# EAGLE design design (EAGLE 7.3.0)

## Sheet 1 of 4: LAN Transformer
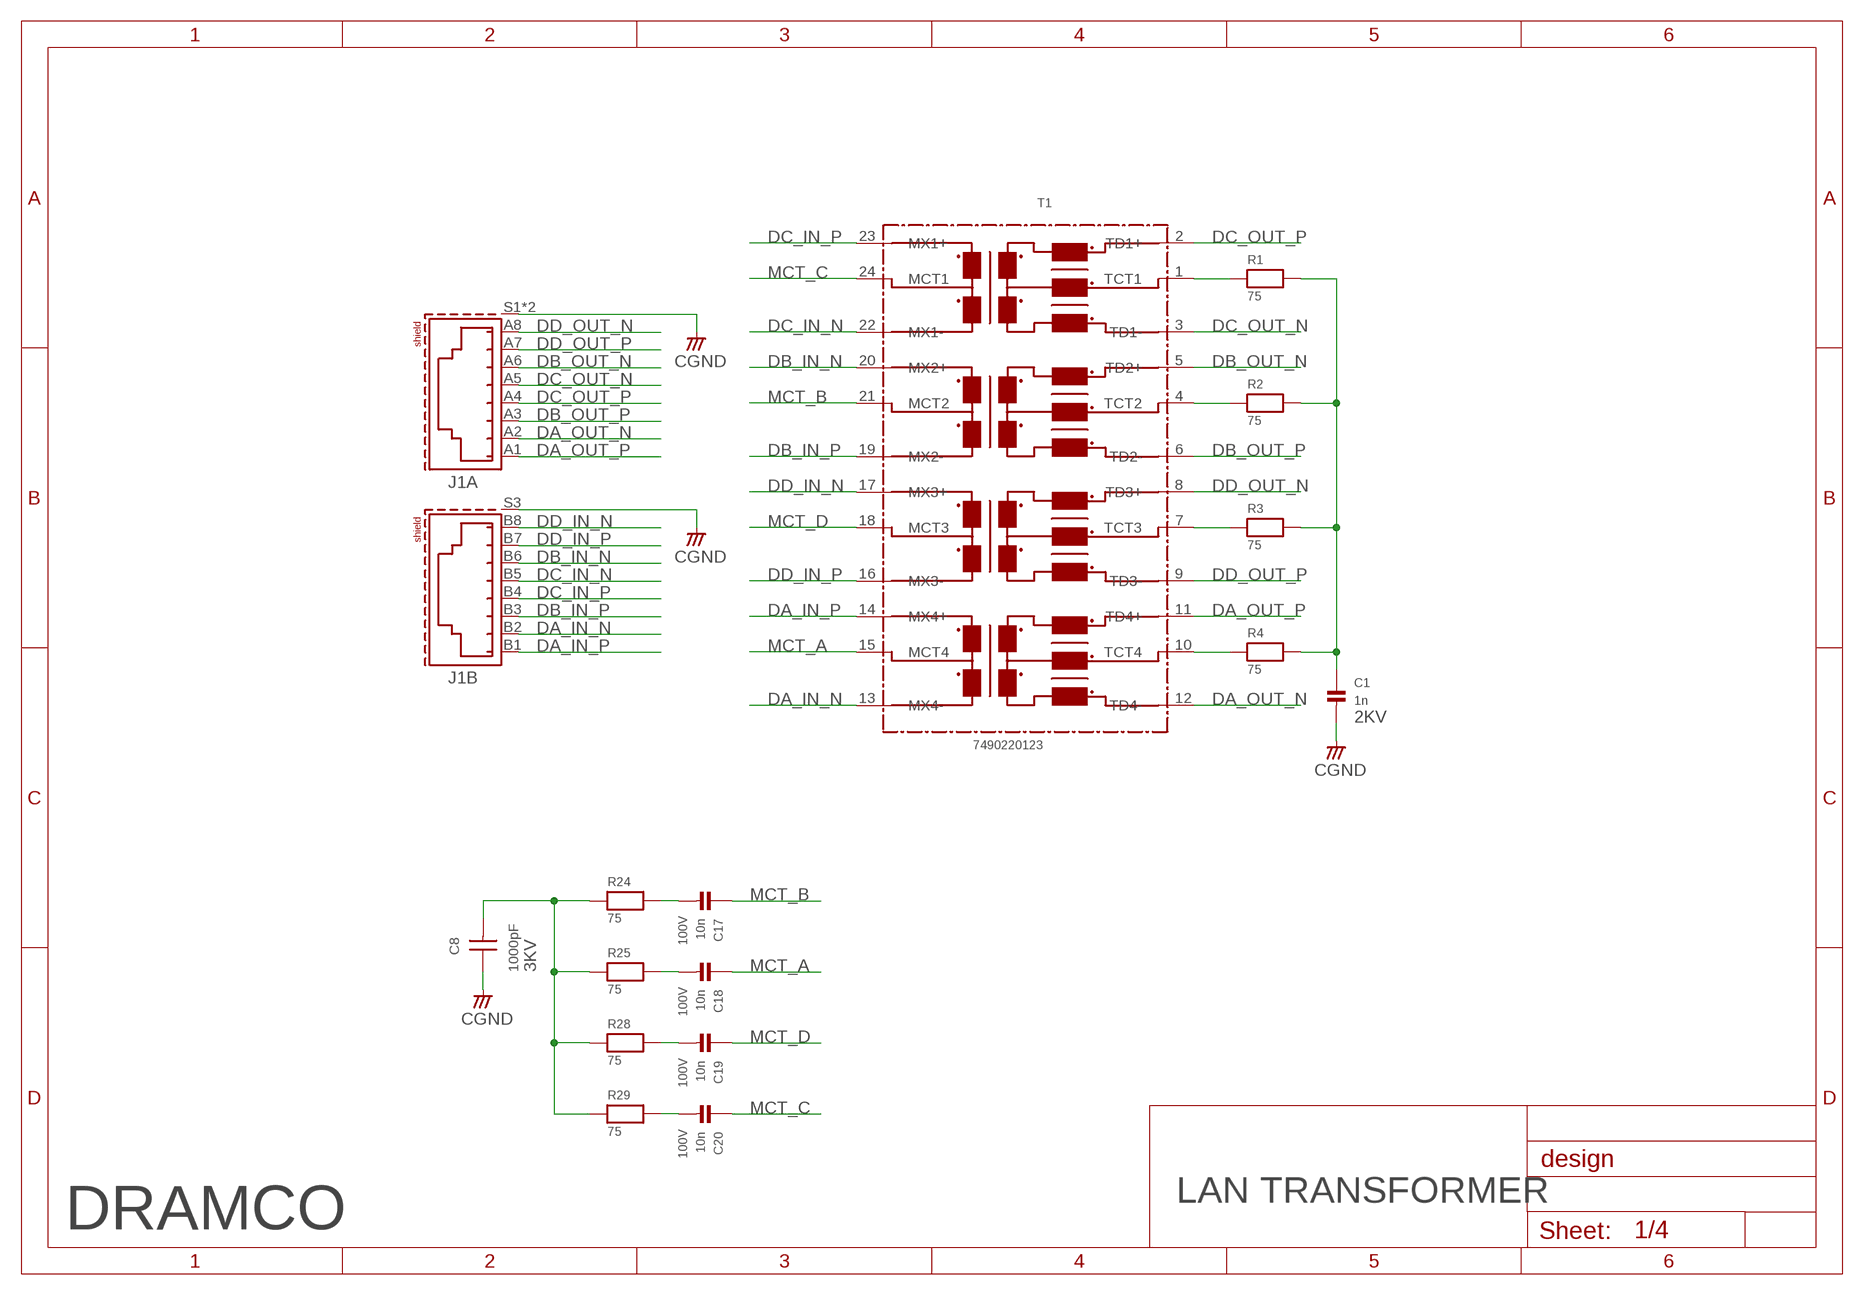
[diagram p0: schematic, sheet 1]

### Parts
C1  1n  CAP_CERAMIC1206  [1206]
C8  1000pF  WCAP-CSMH_1808_H2.0_885342210004  [WCAP-CSMH_1808_H2.0]
C17  10n  CAP_CERAMIC0603  [0603]
C18  10n  CAP_CERAMIC0603  [0603]
C19  10n  CAP_CERAMIC0603  [0603]
C20  10n  CAP_CERAMIC0603  [0603]
J1  615016137621  [615016137621]
R1  75  RESISTOR0805  [0805]
R2  75  RESISTOR0805  [0805]
R3  75  RESISTOR0805  [0805]
R4  75  RESISTOR0805  [0805]
R24  75  RESISTOR0805  [0805]
R25  75  RESISTOR0805  [0805]
R28  75  RESISTOR0805  [0805]
R29  75  RESISTOR0805  [0805]
T1  7490220123  WE-LAN_749022012X_7490220122  [749022012X]

### Nets
CGND: C1.2 C8.1 J1.S1(A:SHIELD) J1.S2(A:SHIELD) J1.S3(B:SHIELD)
DA_IN_N: J1.B2 T1.13(MX4-)
DA_IN_P: J1.B1 T1.14(MX4+)
DA_OUT_N: J1.A2 T1.12(TD4-)
DA_OUT_P: J1.A1 T1.11(TD4+)
DB_IN_N: J1.B6 T1.20(MX2+)
DB_IN_P: J1.B3 T1.19(MX2-)
DB_OUT_N: J1.A6 T1.5(TD2+)
DB_OUT_P: J1.A3 T1.6(TD2-)
DC_IN_N: J1.B5 T1.22(MX1-)
DC_IN_P: J1.B4 T1.23(MX1+)
DC_OUT_N: J1.A5 T1.3(TD1-)
DC_OUT_P: J1.A4 T1.2(TD1+)
DD_IN_N: J1.B8 T1.17(MX3+)
DD_IN_P: J1.B7 T1.16(MX3-)
DD_OUT_N: J1.A8 T1.8(TD3+)
DD_OUT_P: J1.A7 T1.9(TD3-)
MCT_A: C18.1 T1.15(MCT4) ; also sheet 2
MCT_B: C17.1 T1.21(MCT2) ; also sheet 2
MCT_C: C20.1 T1.24(MCT1) ; also sheet 2
MCT_D: C19.1 T1.18(MCT3) ; also sheet 2
N$1: R4.1 T1.10(TCT4)
N$2: R3.1 T1.7(TCT3)
N$3: R2.1 T1.4(TCT2)
N$5: R1.1 T1.1(TCT1)
N$7: C1.1 R1.2 R2.2 R3.2 R4.2
N$9: C8.2 R24.1 R25.1 R28.1 R29.1
N$20: C17.2 R24.2
N$21: C18.2 R25.2
N$22: C19.2 R28.2
N$23: C20.2 R29.2

### Notes on the sheet
- 2KV
- 100V
- 3KV
- 100V
- 100V
- 100V
- LAN TRANSFORMER
- DRAMCO

## Sheet 2 of 4: NCP1096
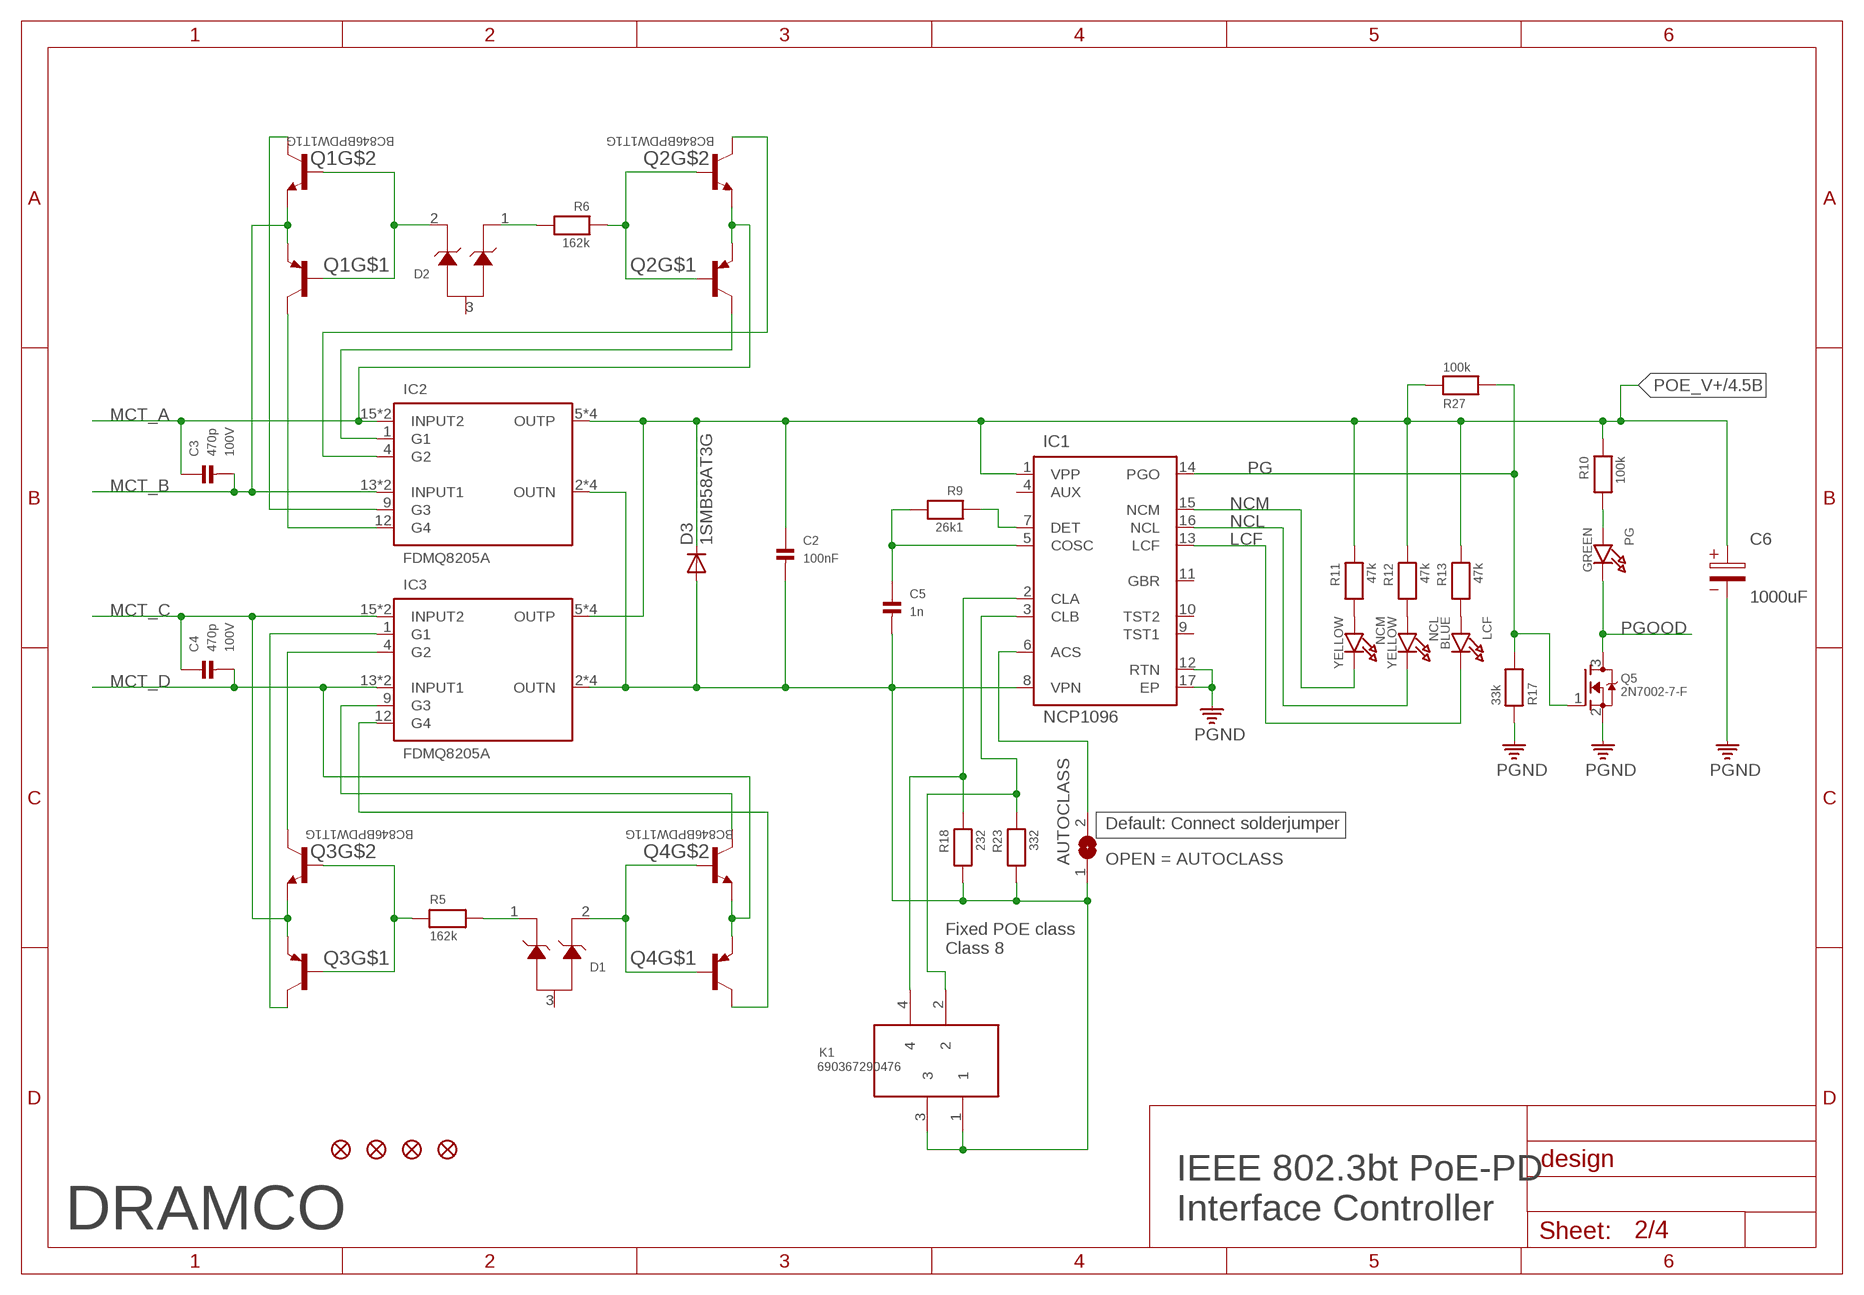
[diagram p1: schematic, sheet 2]

### Parts
AUTOCLASS  SOLDERJUMPERREFLOW  [SOLDERJUMPER_REFLOW]
C2  100nF  CAP_CERAMIC0805  [0805]
C3  470p  CAP_CERAMIC0603  [0603]
C4  470p  CAP_CERAMIC0603  [0603]
C5  1n  CAP_CERAMIC0603  [0603]
C6  1000uF  WCAP-ATG8_16X25_860010780024  [16X7.5X1.1(DXAXB)]
D1  MMBZ27VALT1G  [SOT95P237X111-3N]
D2  MMBZ27VALT1G  [SOT95P237X111-3N]
D3  1SMB58AT3G  DIODE-DO-214AC  [DO-214AC]
FID1  FIDUCIAL""  [FIDUCIAL_1MM]
FID2  FIDUCIAL""  [FIDUCIAL_1MM]
FID3  FIDUCIAL""  [FIDUCIAL_1MM]
FID5  FIDUCIAL""  [FIDUCIAL_1MM]
IC1  NCP1096  NCP1096PAR2G  [TSSOP16]
IC2  FDMQ8205A  [WDFN-12]
IC3  FDMQ8205A  [WDFN-12]
K1  690367290476  [690367290476]
LCF  BLUE  LED0805  [CHIPLED_0805]
NCL  YELLOW  LED0805  [CHIPLED_0805]
NCM  YELLOW  LED0805  [CHIPLED_0805]
PG  GREEN  LED0805  [CHIPLED_0805]
Q1  BC846BPDW1T1G  [SOT65P210X110-6N]
Q2  BC846BPDW1T1G  [SOT65P210X110-6N]
Q3  BC846BPDW1T1G  [SOT65P210X110-6N]
Q4  BC846BPDW1T1G  [SOT65P210X110-6N]
Q5  2N7002-7-F  MOSFET-NWIDE  [SOT23-WIDE]
R5  162k  RESISTOR0603  [0603]
R6  162k  RESISTOR0603  [0603]
R9  26k1  RESISTOR0603  [0603]
R10  100k  RESISTOR0603  [0603]
R11  47k  RESISTOR0603  [0603]
R12  47k  RESISTOR0603  [0603]
R13  47k  RESISTOR0603  [0603]
R17  33k  RESISTOR0603  [0603]
R18  232  RESISTOR0603  [0603]
R23  332  RESISTOR0603  [0603]
R27  100k  RESISTOR0603  [0603]

### Nets
LCF: IC1.13(LCF) LCF.C
MCT_A: C3.1 IC2.15(INPUT2) IC2.16(INPUT2) Q2.1(E2) Q2.4(E1) ; also sheet 1
MCT_B: C3.2 IC2.13(INPUT1) IC2.14(INPUT1) Q1.1(E2) Q1.4(E1) ; also sheet 1
MCT_C: C4.1 IC3.15(INPUT2) IC3.16(INPUT2) Q3.1(E2) Q3.4(E1) ; also sheet 1
MCT_D: C4.2 IC3.13(INPUT1) IC3.14(INPUT1) Q4.1(E2) Q4.4(E1) ; also sheet 1
N$8: IC1.2(CLA) K1.4 R18.1
N$10: NCM.A R11.2
N$11: IC1.7(DET) R9.1
N$12: C5.1 IC1.5(COSC) R9.2
N$13: PG.A R10.2
N$14: Q3.2(B2) Q3.5(B1) R5.1
N$15: NCL.A R12.2
N$16: D1.2 Q4.2(B2) Q4.5(B1)
N$17: IC3.4(G2) Q3.6(C2)
N$18: IC3.1(G1) Q3.3(C1)
N$19: LCF.A R13.2
N$24: IC3.12(G4) Q4.3(C1)
N$25: IC3.9(G3) Q4.6(C2)
N$26: Q2.2(B2) Q2.5(B1) R6.1
N$27: IC1.3(CLB) K1.2 R23.1
N$29: D1.1 R5.2
N$30: AUTOCLASS.2 IC1.6(ACS)
N$31: D2.2 Q1.2(B2) Q1.5(B1)
N$32: IC2.4(G2) Q2.6(C2)
N$33: IC2.1(G1) Q2.3(C1)
N$34: IC2.12(G4) Q1.3(C1)
N$36: D2.1 R6.2
N$37: IC2.9(G3) Q1.6(C2)
NCL: IC1.16(NCL) NCL.C
NCM: IC1.15(NCM) NCM.C
PG: IC1.14(PGO) Q5.1(G) R17.2 R27.2 ; also sheet 3
PGND: C6.2 IC1.12(RTN) IC1.17(EP) Q5.2(S) R17.1 ; also sheet 3
PGOOD: PG.C Q5.3(D) ; also sheet 4
POE_V+: C2.1 C6.1 D3.C IC1.1(VPP) IC2.5(OUTP) IC2.6(OUTP) IC2.7(OUTP) IC2.8(OUTP) IC3.5(OUTP) IC3.6(OUTP) IC3.7(OUTP) IC3.8(OUTP) R10.1 R11.1 R12.1 R13.1 R27.1 ; also sheet 4
VPN: AUTOCLASS.1 C2.2 C5.2 D3.A IC1.8(VPN) IC2.2(OUTN) IC2.3(OUTN) IC2.10(OUTN) IC2.11(OUTN) IC3.2(OUTN) IC3.3(OUTN) IC3.10(OUTN) IC3.11(OUTN) K1.1 K1.3 R18.2 R23.2
Unconnected: D1.3 D2.3 IC1.4(AUX) IC1.9(TST1) IC1.10(TST2) IC1.11(GBR)

### Notes on the sheet
- 100V
- 100V
- Default: Connect solderjumper
- OPEN = AUTOCLASS
- Fixed POE class
  Class 8
- IEEE 802.3bt PoE-PD 
  Interface Controller
- DRAMCO

## Sheet 3 of 4: FlyBack Conv + Connectoren
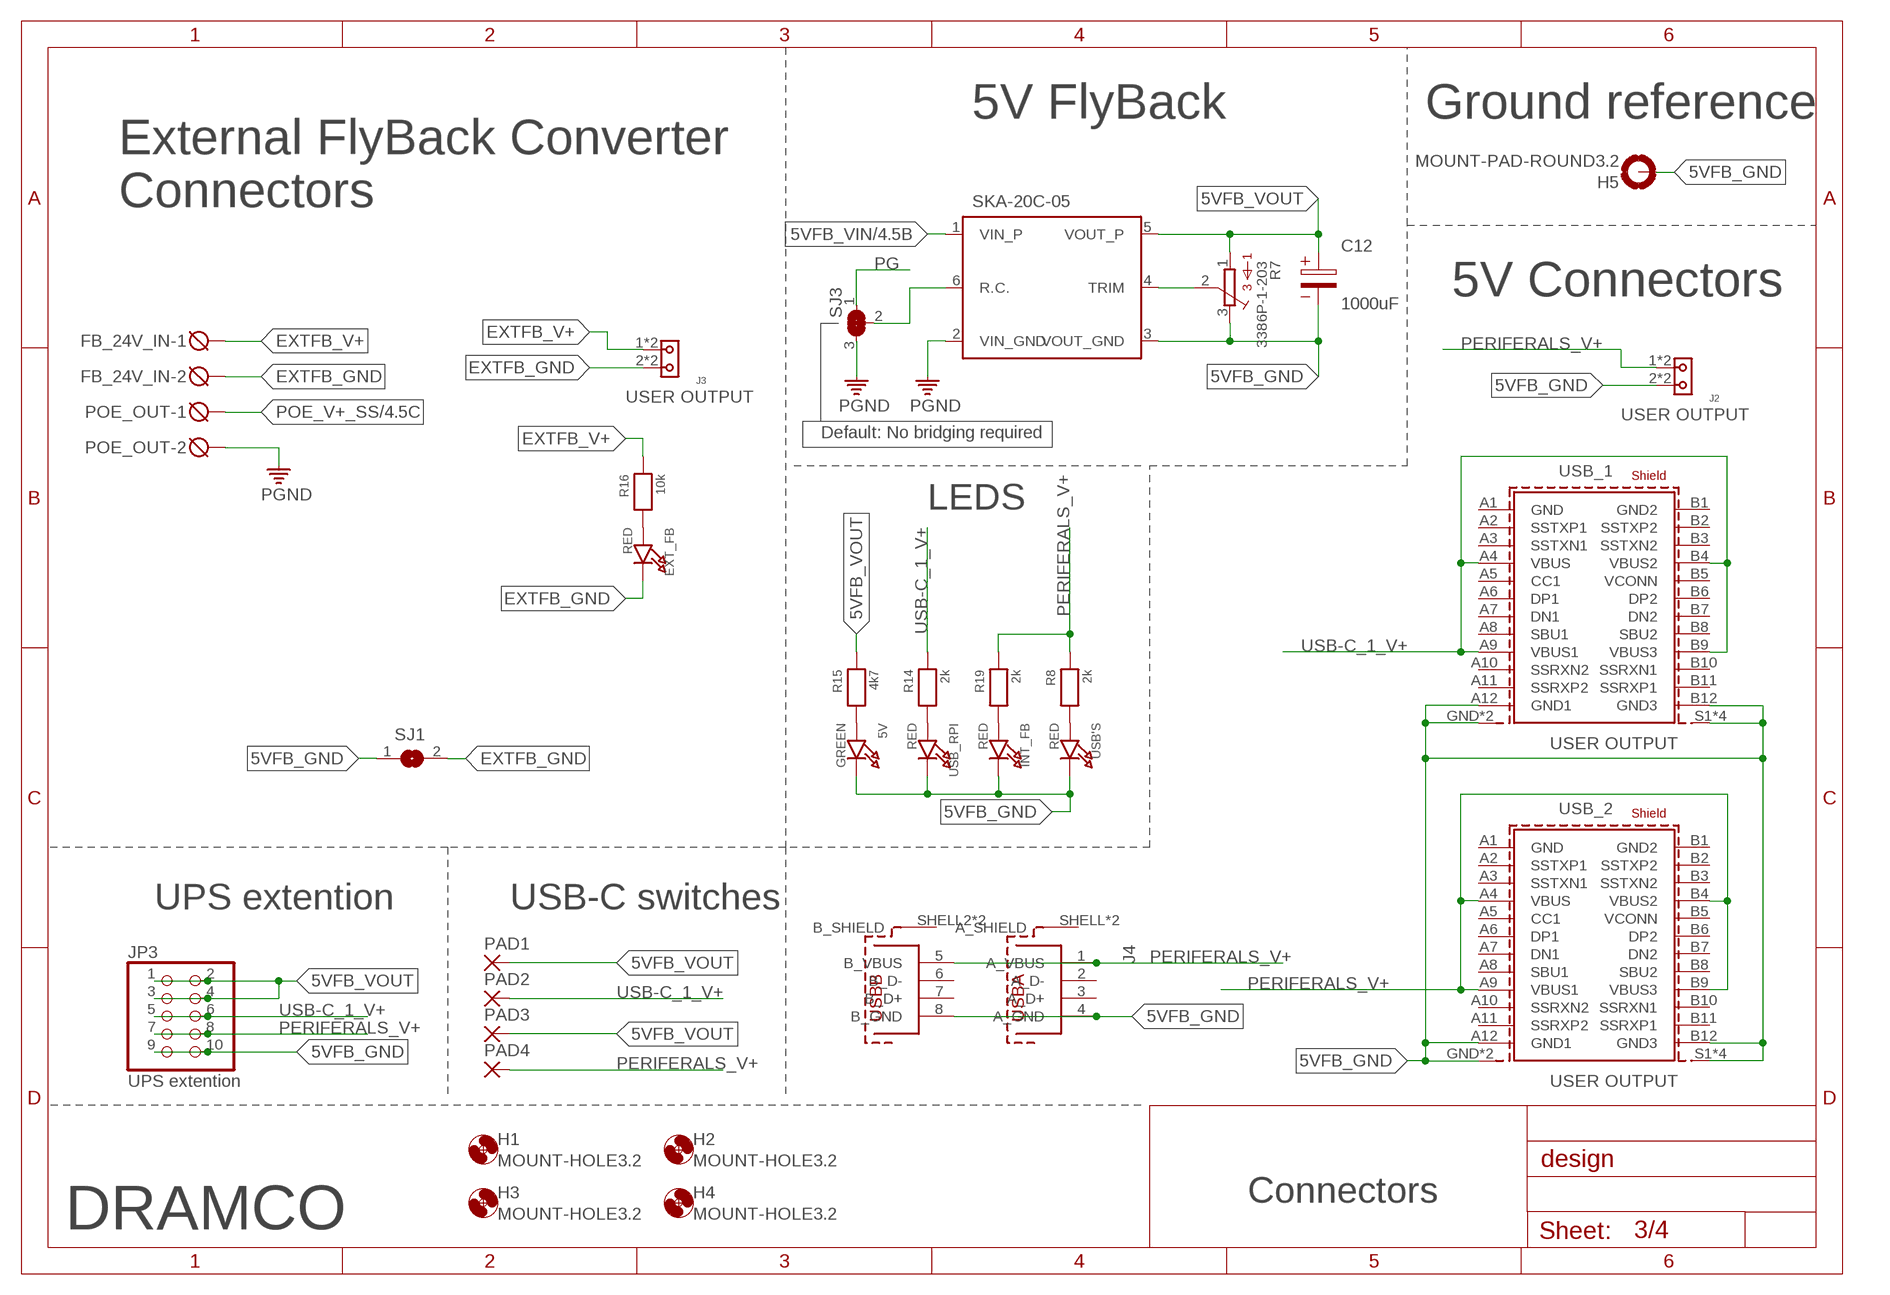
[diagram p2: schematic, sheet 3]

### Parts
5V  GREEN  LED0805  [CHIPLED_0805]
C12  1000uF  WCAP-AT1H_10X16_860240275008  [10X5X0.9(DXAXB)]
EXT_FB  RED  LED0805  [CHIPLED_0805]
FB_24V_IN  DG3XX-02-5.0  [DG306-5.0-02P]
H1  MOUNT-HOLE3.2  [3,2]
H2  MOUNT-HOLE3.2  [3,2]
H3  MOUNT-HOLE3.2  [3,2]
H4  MOUNT-HOLE3.2  [3,2]
H5  MOUNT-PAD-ROUND3.2  [3,2-PAD]
INT_FB  RED  LED0805  [CHIPLED_0805]
J2  691411510002  [691411510002]
J3  691411510002  [691411510002]
J4  61400826021  [61400826021]
JP3  UPS extention  HEADER-2X5  [2X05]
PAD1  SMD5  [SMD2,54-5,08]
PAD2  SMD5  [SMD2,54-5,08]
PAD3  SMD5  [SMD2,54-5,08]
PAD4  SMD5  [SMD2,54-5,08]
POE_OUT  DG3XX-02-5.0  [DG306-5.0-02P]
R7  3386P-1-203  3386-P  [3386P]
R8  2k  RESISTOR0603  [0603]
R14  2k  RESISTOR0603  [0603]
R15  4k7  RESISTOR0603  [0603]
R16  10k  RESISTOR0603  [0603]
R19  2k  RESISTOR0603  [0603]
SJ1  SOLDERJUMPERREFLOW  [SOLDERJUMPER_REFLOW]
SJ3  SOLDERJUMPER_2WAY  [SOLDERJUMPER_2WAY_OPEN_NOPASTE]
SKA-20C-05  SKA20C-05  [SKA20SERIES]
USB'S  RED  LED0805  [CHIPLED_0805]
USB_1  632723100011  [632723100011]
USB_2  632723100011  [632723100011]
USB_RPI  RED  LED0805  [CHIPLED_0805]

### Nets
5VFB_GND: 5V.C C12.2 H5.B3,2(MOUNT) INT_FB.C J2.2 J2.A2 J4.4(A_GND) J4.8(B_GND) JP3.9 JP3.10 R7.3 SJ1.1 SKA-20C-05.3(VOUT_GND) USB'S.C USB_1.A12(GND1) USB_1.B12(GND3) USB_1.GND1(SHIELD) USB_1.GND(SHIELD) USB_1.S1(SHIELD1) USB_1.S2(SHIELD1) USB_1.S3(SHIELD1) USB_1.S4(SHIELD1) USB_2.A12(GND1) USB_2.B12(GND3) USB_2.GND1(SHIELD) USB_2.GND(SHIELD) USB_2.S1(SHIELD1) USB_2.S2(SHIELD1) USB_2.S3(SHIELD1) USB_2.S4(SHIELD1) USB_RPI.C
5VFB_VIN: SKA-20C-05.1(VIN_P) ; also sheet 4
5VFB_VOUT: C12.1 JP3.1 JP3.2 JP3.3 JP3.4 PAD1.1(P) PAD3.1(P) R7.1 R15.1 SKA-20C-05.5(VOUT_P)
EXTFB_GND: EXT_FB.C FB_24V_IN.2 J3.2 J3.A2 SJ1.2
EXTFB_V+: FB_24V_IN.1 J3.1 J3.A1 R16.1
N$6: INT_FB.A R19.2
N$35: R8.2 USB'S.A
N$38: R14.2 USB_RPI.A
N$39: 5V.A R15.2
N$40: EXT_FB.A R16.2
N$41: R7.2 SKA-20C-05.4(TRIM)
N$43: SJ3.2 SKA-20C-05.6(R.C.)
PERIFERALS_V+: J2.1 J2.A1 J4.1(A_VBUS) J4.5(B_VBUS) JP3.7 JP3.8 PAD4.1(P) R8.1 R19.1 USB_2.A4(VBUS) USB_2.A9(VBUS1) USB_2.B4(VBUS2) USB_2.B9(VBUS3)
PG: SJ3.1 ; also sheet 2
PGND: POE_OUT.2 SJ3.3 SKA-20C-05.2(VIN_GND) ; also sheet 2
POE_V+_SS: POE_OUT.1 ; also sheet 4
USB-C_1_V+: JP3.5 JP3.6 PAD2.1(P) R14.1 USB_1.A4(VBUS) USB_1.A9(VBUS1) USB_1.B4(VBUS2) USB_1.B9(VBUS3)
Unconnected: J4.2(A_D-) J4.3(A_D+) J4.6(B_D-) J4.7(B_D+) J4.SHELL1(A_SHIELD) J4.SHELL2(B_SHIELD) J4.SHELL3(B_SHIELD) J4.SHELL(A_SHIELD) USB_1.A1(GND) USB_1.A2(SSTXP1) USB_1.A3(SSTXN1) USB_1.A5(CC1) USB_1.A6(DP1) USB_1.A7(DN1) USB_1.A8(SBU1) USB_1.A10(SSRXN2) USB_1.A11(SSRXP2) USB_1.B1(GND2) USB_1.B2(SSTXP2) USB_1.B3(SSTXN2) USB_1.B5(VCONN) USB_1.B6(DP2) USB_1.B7(DN2) USB_1.B8(SBU2) USB_1.B10(SSRXN1) USB_1.B11(SSRXP1) USB_2.A1(GND) USB_2.A2(SSTXP1) USB_2.A3(SSTXN1) USB_2.A5(CC1) USB_2.A6(DP1) USB_2.A7(DN1) USB_2.A8(SBU1) USB_2.A10(SSRXN2) USB_2.A11(SSRXP2) USB_2.B1(GND2) USB_2.B2(SSTXP2) USB_2.B3(SSTXN2) USB_2.B5(VCONN) USB_2.B6(DP2) USB_2.B7(DN2) USB_2.B8(SBU2) USB_2.B10(SSRXN1) USB_2.B11(SSRXP1)

### Notes on the sheet
- 5V FlyBack | Ground reference
- External FlyBack Converter
  Connectors
- 5V Connectors
- USER OUTPUT
- USER OUTPUT
- Default: No bridging required
- LEDS
- USER OUTPUT
- UPS extention | USB-C switches
- USER OUTPUT
- Connectors
- DRAMCO

## Sheet 4 of 4: Soft Start
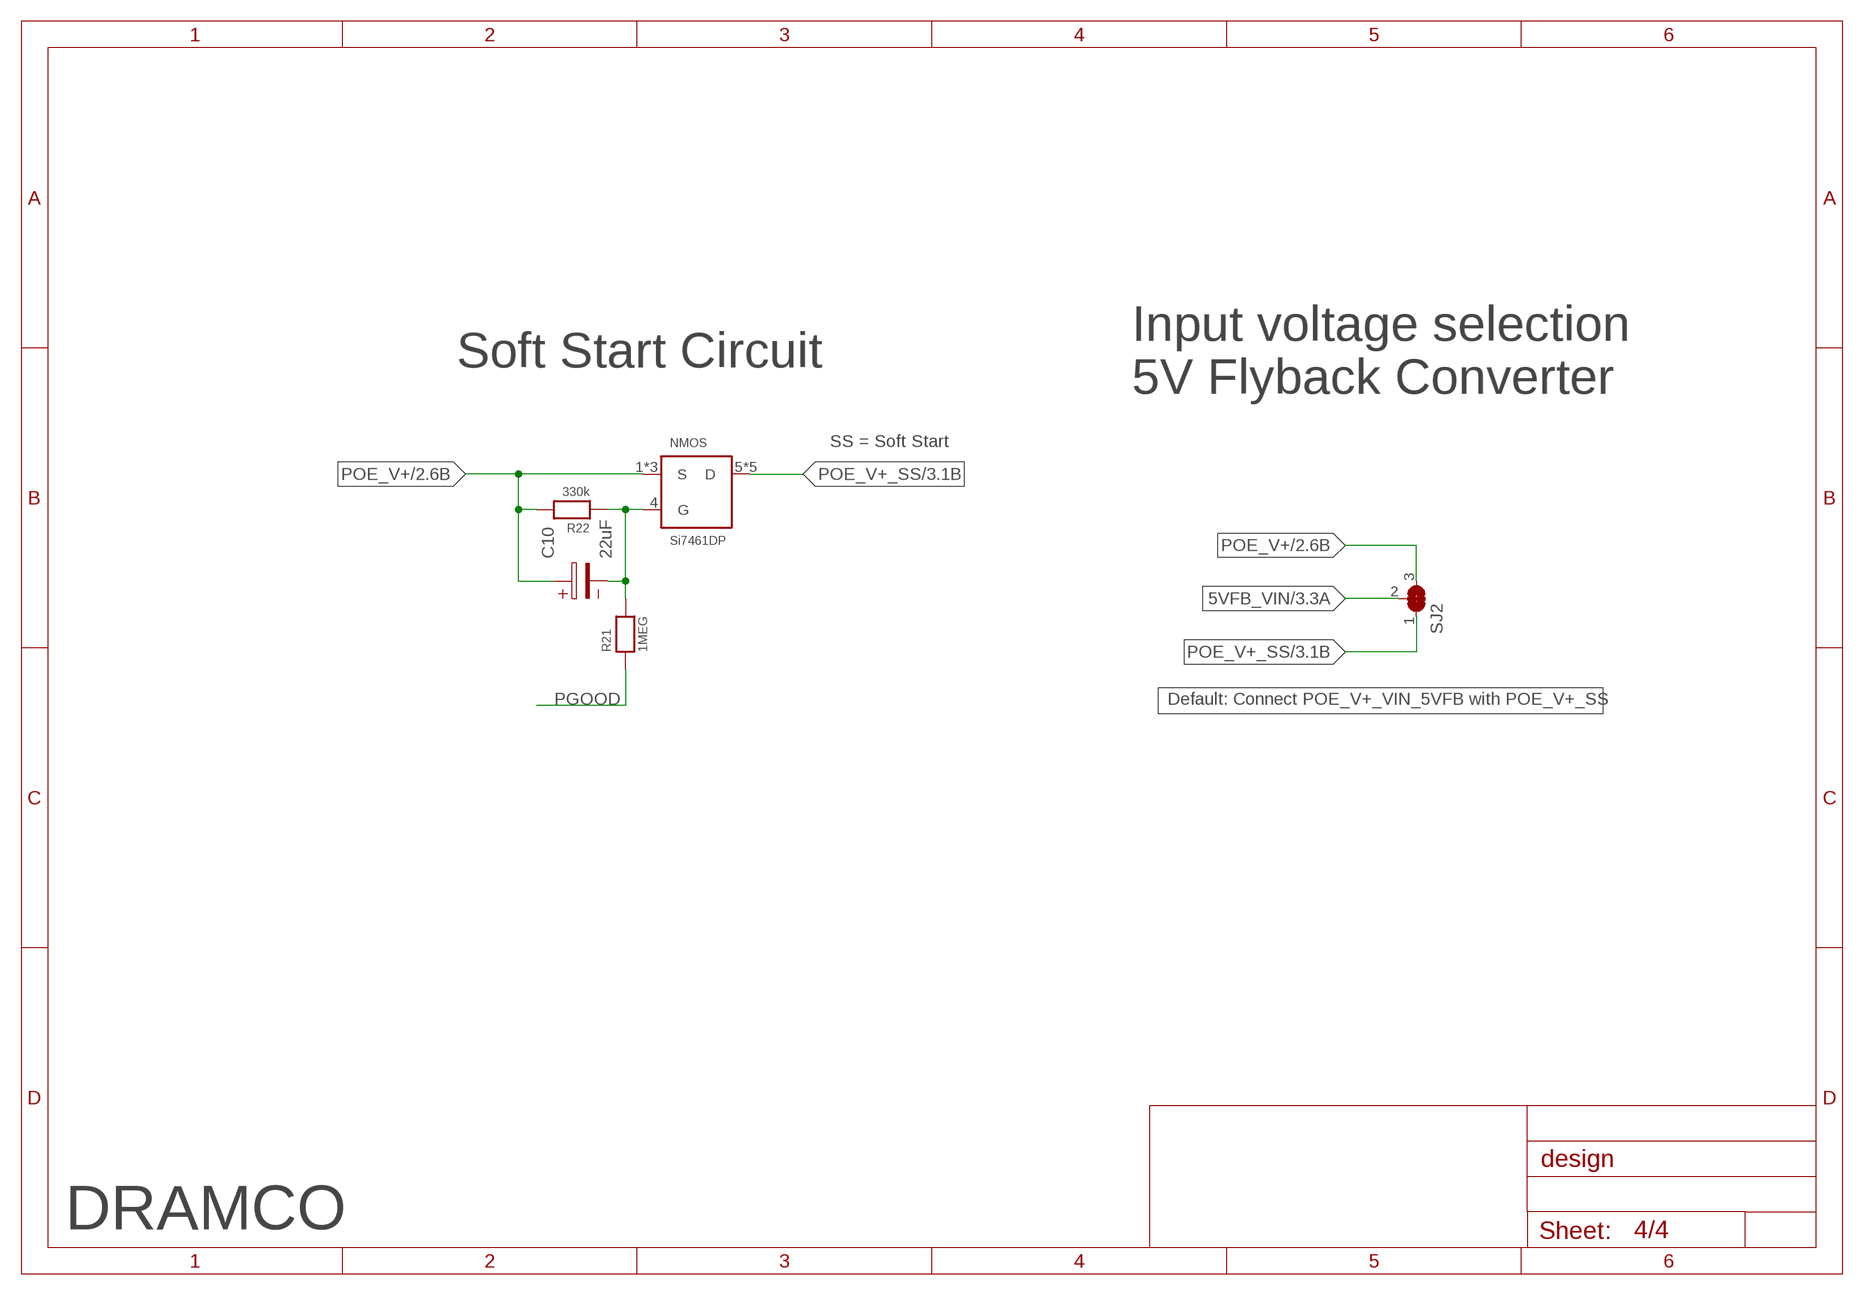
[diagram p3: schematic, sheet 4]

### Parts
C10  22uF  WCAP-ATG5_5X11_860020472004  [5X2X0.8(DXAXB)]
NMOS  Si7461DP  SI7461DP  [SO-8]
R21  1MEG  RESISTOR0603  [0603]
R22  330k  RESISTOR0603  [0603]
SJ2  SOLDERJUMPER_2WAY  [SOLDERJUMPER_2WAY_OPEN_NOPASTE]

### Nets
5VFB_VIN: SJ2.2 ; also sheet 3
N$4: C10.2 NMOS.4(G) R21.2 R22.1
PGOOD: R21.1 ; also sheet 2
POE_V+: C10.1 NMOS.1(S) NMOS.2(S) NMOS.3(S) R22.2 SJ2.3 ; also sheet 2
POE_V+_SS: NMOS.5(D) NMOS.6(D) NMOS.7(D) NMOS.8(D) NMOS.9(D) SJ2.1 ; also sheet 3

### Notes on the sheet
- Soft Start Circuit
- Input voltage selection 
  5V Flyback Converter
- SS = Soft Start
- Default: Connect POE_V+_VIN_5VFB with POE_V+_SS
- DRAMCO

## Library data of the parts
5V EXT_FB INT_FB LCF NCL NCM PG USB'S USB_RPI = microbuilder:LED: LED 0603 - 0603 Surface Mount Package 2mA: Green LED - Low Power (3.9mcd, 2ma, 1.7Vf) - Digikey: 475-2709-2-ND Orange LED - Low Power (9.8mcd, 2ma, 1.8Vf) - Digikey: 475-1194-2-ND Red LED - Low Power (5mcd, 2ma, 1.8Vf) - Digikey: 475-1195-2-ND Yellow LED - Low Power (7mcd, 2ma, 1.8Vf) - Digikey: 475-1196-2-ND 5mA: Blue LED - Low Power (17mcd, 5ma, 2.9Vf) - Digikey: LNJ937W8CRACT-ND 0805 - 0805 Surface Mount Package 2mA: Red LED (8.8mcd, 2mA, 1.8Vf, Clear) - Low Power [Digikey: 475-2510-1-ND] Green LED (5mcd, 2mA, 1.8Vf, Clear) - Low Power [Digikey: 475-2730-1-ND] Yellow LED (11.3mcd, 2mA, 1.8Vf, Clear) - Low Power [Digikey: 475-2555-1-ND] 20mA: Red LED (104mcd, 20mA, Diffused) - LS R976 [Digikey: 475-1278-6-ND] Red LED (12mcd, 20mA, 2.0Vf, Clear) - APT2012EC [Digikey: 754-1128-1-ND] Green LED (15mcd, 20mA, 2.2Vf, Clear) - APT2012GC [Digikey: 754-1131-1-ND] Orange LED (160mcd, 20mA, 2.1Vf, Clear) - APT2012SECK [Digikey: 754-1130-1-ND] 1206 - 1206 Surface Mount Package Green LED (26mcd, 20mA, Diffused) - LG N971 [Digikey: 475-1407-6-ND] Red LED (15mcd, 20mA, Diffused) - LH N974 [Digikey: 475-1416-6-ND]
AUTOCLASS SJ1 = microbuilder:SOLDERJUMPER: SMD Solder JUMPER Solder the two pads together to create a connection, or remove the solder to break it. REFLOW - Use this footprint for solder paste and reflow ovens. WAVE - Use this footprint for hand-soldering (larger pads). CLOSED - Has a trace between the two pads to ensure it is closed by default. The trace needs to be cut to disable the jumper, and can be closed again by creating a solder bridge between the two pads.
C1-C5 C17-C20 = microbuilder:CAP_CERAMIC: Ceramic Capacitors 0402 - 0402 Surface Mount Capacitors 16pF 50V 5% [Digikey: 445-4899-2-ND] 18pF 50V 5% [Digikey: 490-1281-2-ND] 22pF 50V 5% [Digikey: 490-1283-2-ND] 68pF 50V 5% [Digikey: 490-1289-2-ND] 0.1uF 10V 10% [Digikey: 490-1318-2-ND] 1.0uF 6.3V 10% [Digikey: 490-1320-2-ND] 0603 - 0603 Surface Mount Capacitors 16 pF 50V 5% [Digikey: 445-5051-2-ND] 22 pF 50V [Digikey: PCC220ACVTR-ND] 33 pF 50V 5% [Digikey: 490-1415-1-ND] 56pF 50V 5% [Digikey: 490-1421-1-ND] 220pF 50V 5% [Digikey: 445-1285-1-ND] 680 pF 50V 2200 pF 50V 5% C0G [Digikey: 445-1297-1-ND] 5600 pF 100V 5% X7R [Digikey: 478-3711-1-ND] 0.1 µF 25V 10% [Digikey: PCC2277TR-ND] 0.22 µF 16V 10% X7R [Digikey: 445-1318-1-ND] 1.0 µF 25V 10% [Digikey: 445-5146-2-ND] 0603 - RF Specific 3pF 250V +/-0.1pF RF [Digikey: 712-1347-1-ND] 18 pF 250V 5% [Digikey: 478-3505-1-ND or 712-1322-1-ND] 56 pF 250V 5% C0G RF [Digikey: 490-4867-1-ND] 68 pF 250V RF [Digikey: 490-4868-1-ND] 0805 - 0805 Surface Mount Capacitors 220 pF 250V 2% RF Ceramic Capacitor [Digikey: 712-1398-1-ND] 1000 pF 50V 2% NP0 Ceramic Capacitor [Digikey: 478-3760-1-ND] 0.1 µF 25V 10% Ceramic Capacitor [Digikey: PCC1828TR-ND] 1.0 µF 16V 10% Ceramic Capacitor[Digikey: 490-1691-2-ND] 10.0 µF 10V 10% Ceramic Capacitor[Digikey: 709-1228-1-ND] 10.0 uF 16V 10% Ceramic Capacitor [Digikey: 478-5165-2-ND] 47 uF 6.3V 20% Ceramic Capacitor [Digikey: 587-1779-1-ND or 399-5506-1-ND] 1206 - 1206 Surface Mount Capacitors 47uF 10V 20% Ceramic Capacitor [Digikey: 490-5528-1-ND or 399-5508-1-ND or 445-6010-1-ND] 100uF 6.3V -20%, +80% Y5V Ceramic Capacitor (Digikey: 490-4512-1-ND, Mouser: 81-GRM31CF50J107ZE1L)
C6 = Kondensatoren (rev19a):WCAP-ATG8: WCAP-ATG8 Aluminum Electrolytic Capacitors Characteristics Aluminum Electrolytic Capacitor Recommended soldering: Wave Operating temperature: -40 °C to +85 °C for UR ˂ 400 V; -25 °C to +85 °C for UR ≥ 400V Wide capacitance value range Load life: 2000 h @ + 85 °C Package name and Variant abbreviation: Package: D X A X B = Diameter of the outline X Pitch of the hole X Diameter of the hole. Variant: D X L X P X Ø = Diameter of the body part X Height of the body part X Pitch of the pin X Diameter of the pin. <http://katalog.we-online.de/media/images/eisos/WCAP-ATG8_pf2.jpg> Details see: http://katalog.we-online.de/en/pbs/WCAP-ATG8 Created: 2015-02-06 2015 (C) Wurth Elektronik; WE-NUBMER: 860010780024/1000uF
C8 = Eagle_WCAP-CSMH_rev20a:WCAP-CSMH_1808_H2.0: WCAP-CSMH MLCCs Mid and High Voltage Characteristics Product series for mid and high voltage up to 3 kV(DC) Mounting style: SMT-Chip Ceramic: NP0 (Class I), X7R (Class II) Capacitance range: 10 pF ‒ 470 nF Temperature Coefficient: ±30 ppm/°C; ±0.54 % for NP0 ±15 % for X7R Voltage range (UR): 200 V(DC) ‒ 3 kV(DC) Operating temperature: -55 °C up to + 125 °C Sizes: 0603 / 0805 / 1206 / 1210 / 1808 / 1812 Termination: Cu/Ni/Sn Recommended soldering: Reflow soldering Wave soldering only valid for 0603, 0805; thickness < 0.85 mm Applications Ports protection against EFT and surge Blocking High voltage coupling Snubber <https://www.we-online.com/catalog/media/o166505v209%20Family_WE-MLCC_1210_dunkelbraun.jpg> Details see: https://www.we-online.com/catalog/en/WCAP-CSMH/ Updated by yingchun,Shan;2020-03-10 2020(C) Würth Elektronik; CERAMIC-TYPE: X7R Class II; DATASHEET-URL: https://www.we-online.com/catalog/datasheet/885342210004.pdf; DF: 2.5%; H: 2mm; OPERATING-TEMPERATURE: -55 / +125°C; PART-NUMBER: 885342210004; QMIN: -; RISO: 10GOhm; TECHNICAL-REFERENCE: X7R1808102KC00DFCT10000; TOL-C: +/- 10%; VR: 3000V(DC)
C10 = Kondensatoren (rev17a):WCAP-ATG5: WCAP-ATG5 Aluminum Electrolytic Capacitors Characteristics Aluminum Electrolytic Capacitor Recommended soldering: Wave Operating temperature: -40 °C to +105 °C for UR ˂ 400 V; -25 °C to +105 °C for UR ≥ 400V General purpose product series with max. temperature of +105 °C Load life: 2000 h @ + 105 °C Package name and Variant abbreviation: Package: D X A X B = Diameter of the outline X Pitch of the hole X Diameter of the hole. . <http://katalog.we-online.de/media/images/eisos/WCAP-ATG5_pf2.jpg> Details see: http://katalog.we-online.de/en/pbs/WCAP-ATG5/ Updated by: Yingchun,Shan Updated: 2017-03-16 2017 (C) Wurth Elektronik; WE-NUBMER: 860020472004/22uF
C12 = Kondensatoren (rev17a):WCAP-AT1H: WCAP-AT1H Aluminum Electrolytic Capacitors Characteristics Aluminum Electrolytic Capacitor Recommended soldering: Wave Operating temperature: -40 °C to +105 °C for UR ˂ 400 V; -25 °C to +105 °C for UR ≥ 400V Long life product series Higher permissible ripple current Load life: 5000-10000 h @ + 105 °C Package name and Variant abbreviation: Package: D X A X B = Diameter of the outline X Pitch of the hole X Diameter of the hole. <http://katalog.we-online.de/media/images/eisos/WCAP-ATIH_pf2.jpg> Details see: http://katalog.we-online.de/en/pbs/WCAP-AT1H/ Updated by: Yingchun,Shan Updated: 2017-03-16 2017 (C) Wurth Elektronik; WE-NUMBER: 860240275008/1000uF
D1 D2 = MMBZ27VALT1G:MMBZ27VALT1G
D3 = diode:DIODE-: DIODE
FB_24V_IN POE_OUT = degson:DG3XX-02: DG350-3.5-02P DG306-5.0-02P
FID1-FID3 FID5 = microbuilder:FIDUCIAL: Fiducial Alignment Points Various fiducial points for machine vision alignment.
H1-H4 = holes:MOUNT-HOLE: MOUNTING HOLE with drill center marker
H5 = holes:MOUNT-PAD-ROUND: MOUNTING PAD, round
IC1 = NCP1096PAR2G:NCP1096PAR2G: The NCP1096 is a member of the ON Semiconductor Power over Ethernet Powered Device (PoE−PD) product family, and allows the device containing the NCP1096 based PD to become an IEEE 802.3af/at and −3bt compliant powered equipment. It incorporates all the required functions for operation within a PoE system such as detection, classification and current limiting during the inrush phase. The NCP1096 supports high-power applications (up to 90 W PoE) through an internal pass transistor. A power good pin guarantees proper disabling/enabling of the adjacent main DC/DC converter. The classification result pins allow for operation according to the assigned power Class (up to Class 8). The NCP1096 also offers Autoclass support and indicates when a short Maintain Power Signature can be implemented. In addition an auxiliary supply detection pin allows NCP1096 to be used in applications where power can be supplied by either PoE or by a wall adapter.
IC2 IC3 = FDMQ8205A:FDMQ8205A
J1 = o163742v244 Eagle_WR-MJ (rev20a):615016137621: WR-MJ Modular Jack Horizontal Shielded Dual Port 8P8C Tab Down KIND PROPERTIES Quality Class:500 Mating cycles General Information Operating Temperature:-40 up to +85 °C Compliance:RoHS Electrical Properties IR1:1.5A Working Voltage: 120V (AC) Withstanding Voltage:1000V (AC) Contact Resistance:20mΩ RISO:500 MΩ Material Properties Insulator MateriaL:PBT Insulator Flammability Rating:UL94 V-0 Color:Black Contact Material:Copper Alloy Contact Plating:Selective Gold Contact Type:Stamped Shielding Material:Bronze Shielding Plating:Nickel Packaging Properties Packaging:Tray <https://www.we-online.com/catalog/media/o33140v209%20Family_WR-MJ_615016137621.jpg> Details see: https://www.we-online.com/catalog/en/MJ_HORIZONTAL_SHIELDED_DUAL_PORT_8P8C_TAB_DOWN/ Updated by Yingchun,Shan 2020-01-02 2020(C) Würth Elektronik; DATASHEET-URL: https://www.we-online.com/catalog/datasheet/615016137621.pdf; MOUNT: THT; PART-NUMBER: 615016137621; TYPE: Horizontal; XPXC: 8P8C
J2 J3 = o166547v244 Eagle_WR-TBL Spring Clamp (rev20a):691411510002: WR-TBL Serie 4115 - 5.08 mm Screwless Horizontal Entry KIND PROPERTIES Pitch 5.08 mm MATERIAL PROPERTIES Insulator Material PA66 Insulator Flammability Rating UL94 V-0 Contact Material INOX Steel Contact Type Stamped Wire Guard Material Copper Alloy GENERAL INFORMATION Operating Temperature -30 up to +120 °C Compliance ROHS & Reach ELECTRICAL PROPERTIES IR UL 10 A IR VDE 10 A Working Voltage [UL] 300 V (AC) Working Voltage [VDE] 250 V (AC) Withstanding Voltage [UL] 1600 V (AC) Withstanding Voltage [VDE] 2000 V (AC) Contact Resistance 20 mΩ Mechanical Properties Wire Strip Length 10 Wire Properties Solid Wire Section (AWG) 16 to 30 (AWG) Solid Wire Section (Metric) 1.31 to 0.0509 (mm²) Stranded Wire Section (AWG) 16 to 30 (AWG) Stranded Wire Section (Metric) 1.31 to 0.0509 (mm²) CERTIFICATION UL Approval E150931 VDE Approval 40021396 Packaging Properties Packaging Box <https://www.we-online.com/catalog/media/o32955v209%20Family_Con_TBL_Screwless_508_6914115100xx_pf2.jpg> Details see: https://www.we-online.com/catalog/en/TBL_5_08_4115_SCREWLESS_HORIZONTAL_ENTRY_6914115100xx/ Updated by Ella Wu 2019-12-31 2019(C) Wurth Elektronik; DATASHEET-URL: https://www.we-online.com/catalog/datasheet/691411510002.pdf; IR-UL: 10A; IR-VDE: 10A; MOUNT: THT; PART-NUMBER: 691411510002; PINS: 2; PITCH: 5.08mm; TYPE: Horizontal; WIRE: 16 to 30 (AWG) 1.31 to 0.0509 (mm²); WORKING-VOLTAGE-UL: 300V (AC); WORKING-VOLTAGE-VDE: 250V (AC)
J4 = InputOutputIO (rev19b):61400826021: WR-COM Horizontal Dual Stacked USB Type A=>Code : Con_I-O_COM_USB-2.0_A_61400826021 <http://katalog.we-online.de/media/images/eican/Con_I-O_COM_USB-2.0_A_61400826021_pf2.jpg> Details see: http://katalog.we-online.de/en/em/614_008_260_21 Created 2014-07-09, Karrer Zheng 2014 (C) Würth Elektronik
JP3 = microbuilder:HEADER-2X5: PIN HEADER
K1 = Wuerth_Elektronik_eiCan_MiniModule_Connectors_v1.2:690367290476: WR-MM Female SMT Connector with Latch and with Polarization, 4 pins
NMOS = Si7461DP:SI7461DP
PAD1-PAD4 = wirepad:SMD5: SMD PAD
Q1-Q4 = BC846BPDW1T1G:BC846BPDW1T1G: Bipolar (BJT) Transistor Array NPN, PNP 45V 100mA 100MHz 380mW Surface Mount SC-88/SC70-6/SOT-363; AVAILABILITY: Unavailable; DESCRIPTION: Bipolar _BJT_ Transistor Array NPN, PNP 65V 100mA 100MHz 380mW Surface Mount SC-88/SC70-6/SOT-363; MF: ON Semiconductor; MP: BC846BPDW1T1G; PACKAGE: SOT-363 ON Semiconductor; PRICE: None
Q5 = microbuilder:MOSFET-N: N-Channel Mosfet LEGEND VDS: Voltage Drain-Source ID: Drain Current RDS(ON): Drain-Source On-State Resistance VGS(TH): Gate-Source Threshold Voltage CISS: Drain-Source Input Capacitance SOT-23 Name VDS ID RDS(ON) VGS(TH) CISS Order Number 2N7002E 60V 260mA 2.5 Ohm 2.5V @ 250uA 26.7pF @ 25V 2N7002ET1GOSTR-ND BSH103 30V 850mA 400 mOhm 400mV @ 1mA 83pF @ 24V BSH103,235-ND BSS138 60V 320mA 1.6 Ohm 1.5V @ 250uA 50pF @ 10V Mouser: 771-BSS138PW115 DMN2075U-7 20V 4.2A 38 mOhm 1V @ 250 uA 594.3pF @ 10V DMN2075U-7DICT-ND * BSS138 good choice for I2C level-shifting
R1-R6 R8-R19 R21-R25 R27-R29 = microbuilder:RESISTOR: Resistors 0402 - 0402 Surface Mount Package 22 Ohm 1% 1/16W [Digikey: 311-22.0LRTR-ND] 33 Ohm 5% 1/16W 1.0K 5% 1/16W 1.5K 5% 1/16W 2.0K 1% 1/16W 10.0K 1% 1/16W [Digikey: 311-10.0KLRTR-ND] 10.0K 5% 1/16W [Digikey: RMCF0402JT10K0TR-ND] 12.1K 1% 1/16W [Digikey: 311-22.0LRTR-ND] 100.0K 5% 1/16W 0603 - 0603 Surface Mount Package 0 Ohm 1/10 Watt 1% Resistor 15 Ohm 1/10 Watt 1% Resistor 33 Ohm 1/10 Watt 1% Resistor 49.9 Ohm 1/10 Watt 1% Resistor 100 Ohm 1/10 Watt 1% Resistor 150 Ohm 1/10 Watt 1% Resistor 240 Ohm 1/10 Watt 1% Resistor 390 Ohm 1/10 Watt 1% Resistor 560 Ohm 1/10 Watt 1% Resistor 680 Ohm 1/10 Watt 1% Resistor 750 Ohm 1/10 Watt 1% Resistor 1.0K Ohm 1/10 Watt 1% Resistor 1.5K Ohm 1/10 Watt 1% Resistor 2.0K Ohm 1/10 Watt 1% Resistor 2.2K Ohm 1/10 Watt 1% Resistor 3.3K Ohm 1/10 Watt 1% Resistor 4.7K Ohm 1/10 Watt 1% Resistor 10.0K Ohm 1/10 Watt 1% Resistor 12.0K Ohm 1/10 Watt 1% Resistor 12.1K Ohm 1/10 Watt 1% Resistor 20.0K Ohm 1/10 Watt 1% Resistor 33.0K Ohm 1/10 Watt 1% Resistor 100.0K Ohm 1/10 Watt 1% Resistor 0805 - 0805 Surface Mount Package 0 Ohm 1/8 Watt 1% Resistor 33 Ohm 1/8 Watt 1% Resistor 100 Ohm 1/8 Watt 1% Resistor 150 Ohm 1/8 Watt 1% Resistor 200 Ohm 1/8 Watt 1% Resistor 240 Ohm 1/8 Watt 1% Resistor 330 Ohm 1/8 Watt 1% Resistor 390 Ohm 1/8 Watt 1% Resistor 470 Ohm 1/8 Watt 1% Resistor 1.0K Ohm 1/8 Watt 1% Resistor 1.5K Ohm 1/8 Watt 1% Resistor 2.0K Ohm 1/8 Watt 1% Resistor 4.7K Ohm 1/8 Watt 1% Resistor 5.1K Ohm 1/8 Watt 1% Resistor 5.6K Ohm 1/8 Watt 1% Resistor 10.0K Ohm 1/8 Watt 1% Resistor 22.0K Ohm 1/8 Watt 1% Resistor 33.0K Ohm 1/8 Watt 1% Resistor 100K Ohm 1/8 Watt 1% Resistor 1206 - 1206 Surface Mount Package 2012 - 2010 Surface Mount Package 0.11 Ohm 1/2 Watt 1% Resistor - Digikey: RHM.11UCT-ND
R7 = bourns:3386-: 3386 Series 3/8" Square Trimmer
SJ2 SJ3 = microbuilder:SOLDERJUMPER_2WAY: 2-Way Solder Jumper
SKA-20C-05 = SKA20_Series_V2:SKA20C-05
T1 = EMCComponents (rev19b):WE-LAN_749022012X: WE-LAN LAN Transformer Characteristics Compliant with standards: IEEE 802.3u, IEEE 802.3ab, IEEE 802.3af, IEEE 802.3at and upcoming IEE 802.3bt SMD Applications Ethernet speed up to 10 Gbit/s Power over Ethernet PoE and PoE+ Compliant with most IC’s for Ethernet applications such as Intel, AMD, Microchip and Realtek Hub, Router, Switches, IPcameras, IoT <http://katalog.we-online.de/media/images/v2/WE-LAN%20-%20Kopie.jpg> Details see: http://katalog.we-online.de/en/pbs/WE-LAN Created by Yingchun Shan 2016 (C) Wurth Elektronik
USB_1 USB_2 = o163744v244 Eagle_WR-USB (rev20a):632723100011: WR-COM USB 3.1 Type C Receptacle Horizontal THT/SMT Kind Properties Durability:10 000 Mating cycles Connector Type:USB 3.1 Type C Gender:Receptacle Type:Horizontal General Information Operating Temperature:-40up to +105 °C Compliance:RoHS Electrical Properties Working Voltage:20V (DC) Withstanding Voltage:100V (AC) Contact Resistance:30 mΩ Material Properties Insulator Material:LCP Insulator Flammability Rating:UL94 V-0 Color:Black Contact Material:Brass Contact Plating:2µ” Gold over 30µ” Pd-Ni Contact Type:Stamped Shielding Material:Steel Shielding Plating:Matte Tin <https://www.we-online.com/catalog/media/o144501v209%20Family_WR-COM_632723x00011.jpg> Details see: https://www.we-online.com/catalog/en/COM_3_1_THR_SMT_TYPE_C_RECEPTACLE_HORIZONTAL/ Updated by Yingchun, Shan 2020-01-17 2020 (C) Würth Elektronik; APPLICATION: USB 3.1; DATASHEET-URL: https://www.we-online.com/catalog/datasheet/632723100011 .pdf; GERDER: Receptacle; INTERFACE-TYPE: Type C; MOUNT: THR; PACKAGING: Tape and Reel; PART-NUMBER: 632723100011; PINS: 24; TYPE: Horizontal; WORKING-VOLTAGE: 20V(DC)

## Board
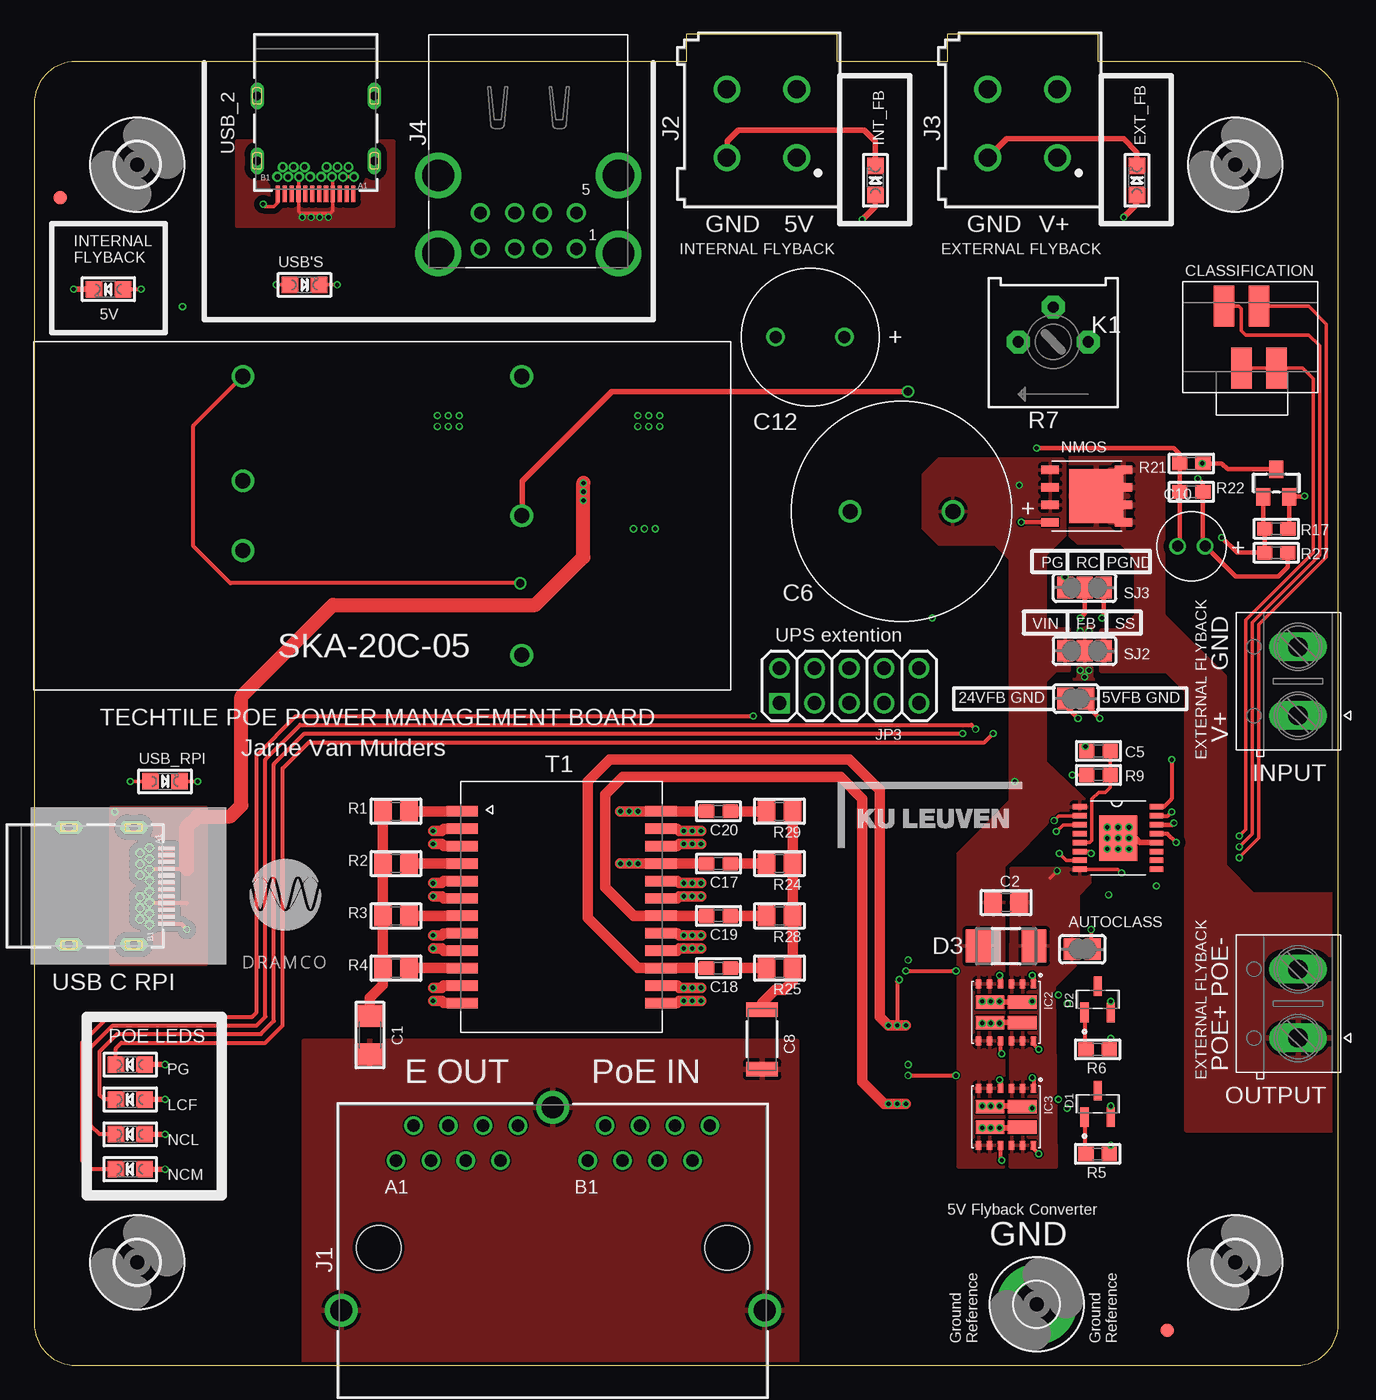
[diagram p4: board, top side]
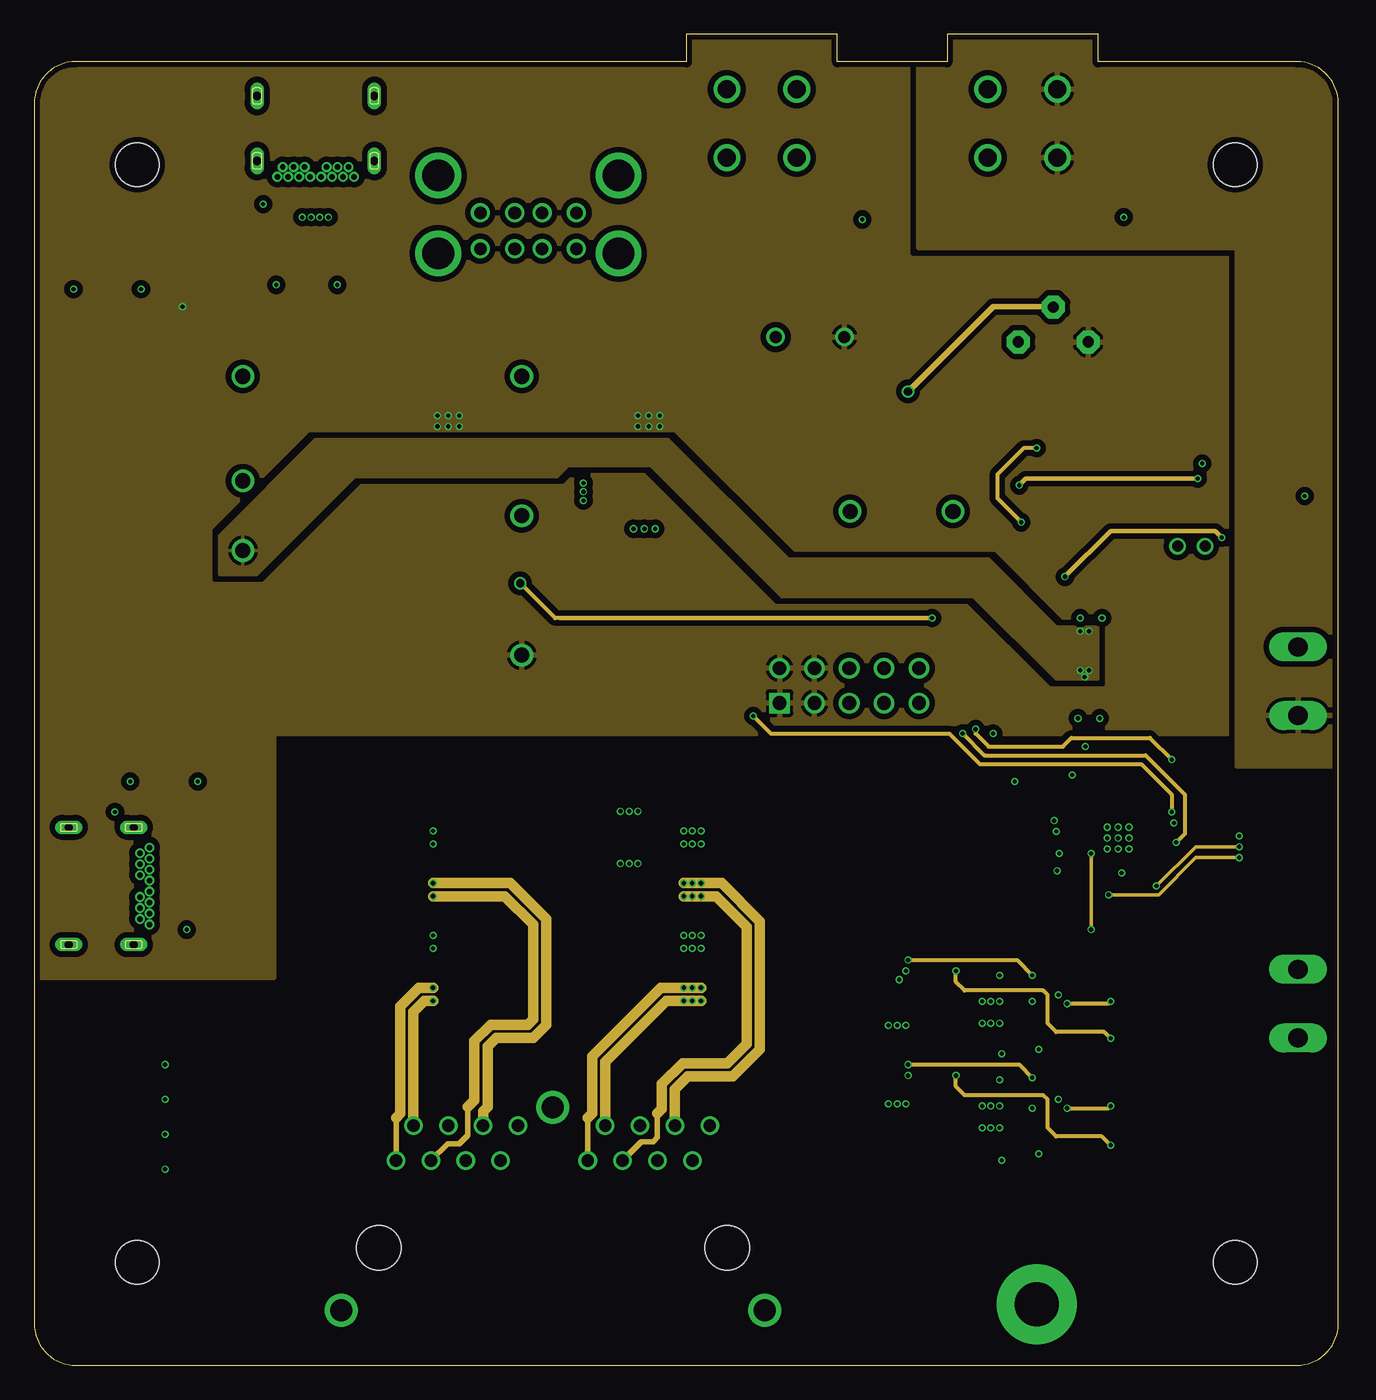
[diagram p5: board, inner layer Route2]
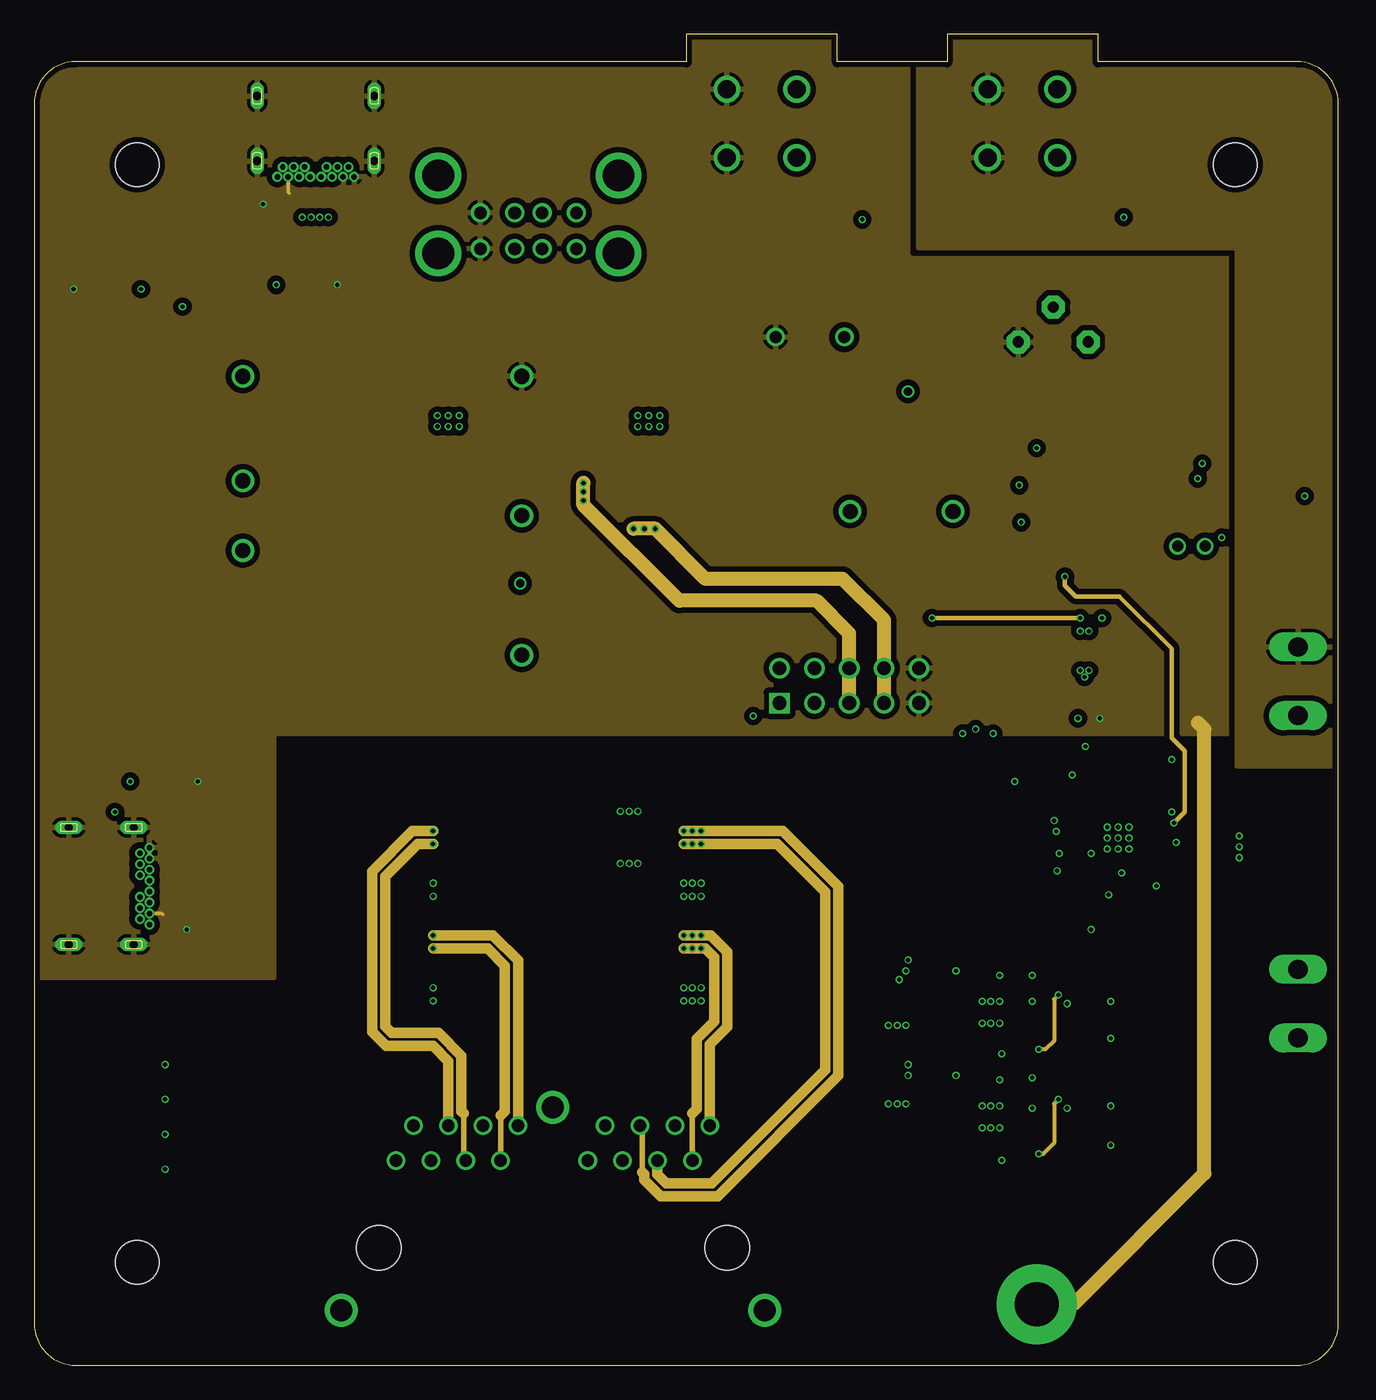
[diagram p6: board, inner layer Route15]
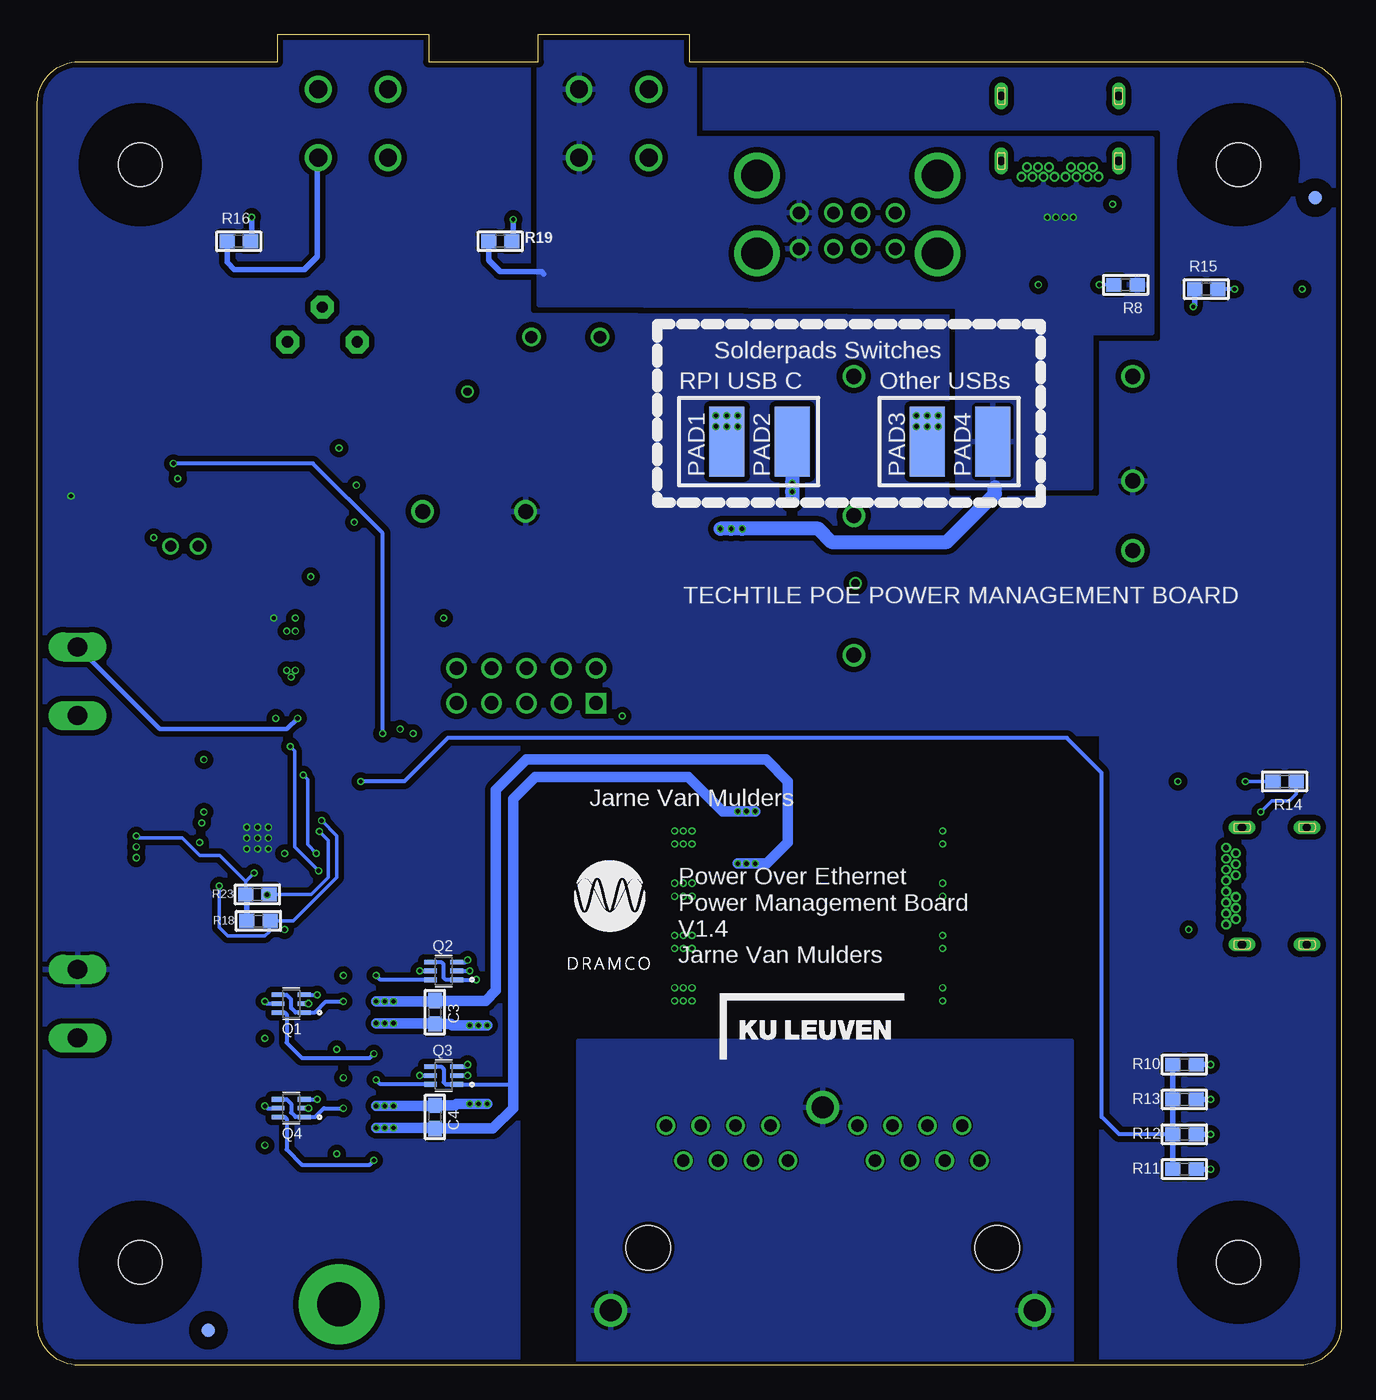
[diagram p7: board, bottom side, seen from below]

Size 95 x 97 mm. Coordinates in mm from the lower left corner, seen from the top.
Outline: 0,92 0,3 arc90 3,0 92,0 arc90 95,3 95,92 arc90 92,95 77.5,95 77.5,97 66.5,97 66.5,95 58.5,95 58.5,97 47.5,97 47.5,95 3,95 arc90 0,92
Copper layers (1*2*15*16): Top 0.035mm / dielectric 0.2mm / Route2 0.0175mm / dielectric 0.3mm / Route15 0.0175mm / dielectric 0.2mm / Bottom 0.035mm
Design rules "SeeedStudio_4layer_DRU_no_angle_20140221 *": minimum track width 8mil, minimum drill 12mil, track to track 4mil, track to pad 4mil, pad to pad 3mil, via to via 8mil, smd to smd 0mil, copper to edge 10mil, drill to drill 8mil, minimum pad ring 6mil, minimum via ring 4mil, stop-mask expansion 4mil, vias tented up to drill 100mil, thermal gap 10mil

### Footprints (pad centres in the part's own frame; a part is rotated, then mirrored left to right if it is on the bottom)
CHIPLED_0805 = smd 1.2 x 1.2: A 0,-1.05; C 0,1.05
SOLDERJUMPER_REFLOW = smd 1.168 x 1.6: 1 -0.762,0; 2 0.762,0
1206 = smd 1.6 x 1.8: 1 -1.4,0; 2 1.4,0
0805 = smd 1.3 x 1.5: 1 -0.95,0; 2 0.95,0
0603 = smd 1.1 x 1: 1 -0.85,0; 2 0.85,0
16X7.5X1.1(DXAXB) = drill 1.1: 1 3.75,0; 2 -3.75,0
WCAP-CSMH_1808_H2.0 = smd 1.05 x 2.3: 1 -2.175,0; 2 2.175,0
5X2X0.8(DXAXB) = drill 0.8: 1 1,0; 2 -1,0
10X5X0.9(DXAXB) = drill 0.9: 1 2.5,0; 2 -2.5,0
SOT95P237X111-3N = smd 1.43 x 0.6: 1 -0.96,0.95; 2 -0.96,-0.95; 3 0.96,0
DO-214AC = smd 1.8 x 2.4: A 2.025,0; C -2.025,0
DG306-5.0-02P = drill 1.4 long: 1 -2.5,0; 2 2.5,0
FIDUCIAL_1MM = smd 1 x 1: 1 0,0
3,2 = hole 3.2: 0,0
3,2-PAD = drill 3.2 pad 5.842: B3,2 0,0
TSSOP16 = smd 0.4 x 1: 1 -2.275,-2.8; 2 -1.625,-2.8; 3 -0.975,-2.8; 4 -0.325,-2.8; 5 0.325,-2.8; 6 0.975,-2.8; 7 1.625,-2.8; 8 2.275,-2.8; 9 2.275,2.8; 10 1.625,2.8; 11 0.975,2.8; 12 0.325,2.8; 13 -0.325,2.8; 14 -0.975,2.8; 15 -1.625,2.8; 16 -2.275,2.8 | smd 3.33 x 2.76: 17 0,0
WDFN-12 = smd 0.4 x 0.65: 1 -2,-2.075; 2 -1.2,-2.075; 3 -0.4,-2.075; 4 0.4,-2.075; 5 1.2,-2.075; 6 2,-2.075; 7 2,2.075; 8 1.2,2.075; 9 0.4,2.075; 10 -0.4,2.075; 11 -1.2,2.075; 12 -2,2.075 | smd 2.1 x 1: 13 -1.175,-0.75; 14 1.175,-0.75; 15 1.175,0.75; 16 -1.175,0.75
615016137621 = drill 0.9: A1 -11.43,6.565; A2 -10.16,9.105; A3 -8.89,6.565; A4 -7.62,9.105; A5 -6.35,6.565; A6 -5.08,9.105; A7 -3.81,6.565; A8 -2.54,9.105; B1 2.54,6.565; B2 3.81,9.105; B3 5.08,6.565; B4 6.35,9.105; B5 7.62,6.565; B6 8.89,9.105; B7 10.16,6.565; B8 11.43,9.105 | drill 1.6: S1 -15.435,-4.355; S2 0,10.455; S3 15.435,-4.355 | hole 3.25: -12.7,0.215; 12.7,0.215
691411510002 = drill 1.3: 1 -2.54,2.5; 2 2.54,2.5; A1 -2.54,-2.5; A2 2.54,-2.5
61400826021 = drill 0.92: 1 -3.5,5.33; 2 -1,5.33; 3 1,5.33; 4 3.5,5.33; 5 -3.5,2.71; 6 -1,2.71; 7 1,2.71; 8 3.5,2.71 | drill 2.3: SHELL -6.57,5.68; SHELL1 6.57,5.68; SHELL2 6.57,0; SHELL3 -6.57,0
2X05 = drill 1 square: 1 -5.08,-1.27 | drill 1: 2 -5.08,1.27; 3 -2.54,-1.27; 4 -2.54,1.27; 5 0,-1.27; 6 0,1.27; 7 2.54,-1.27; 8 2.54,1.27; 9 5.08,-1.27; 10 5.08,1.27
690367290476 = smd 1.5 x 3: 1 6.35,-2.25; 2 5.08,2.25; 3 3.81,-2.25; 4 2.54,2.25
SO-8 = smd 1.27 x 0.61: 1 -2.67,1.905; 2 -2.67,0.635; 3 -2.67,-0.635; 4 -2.67,-1.905; 5 2.67,1.905; 6 2.67,0.635; 7 2.67,-0.635; 8 2.67,-1.905 | smd 3.91 x 3.91: 9 0.69,0
SMD2,54-5,08 = smd 2.54 x 5.08: 1 0,0
SOT65P210X110-6N = smd 1.02 x 0.36: 1 -0.955,0.65; 2 -0.955,0; 3 -0.955,-0.65; 4 0.955,-0.65; 5 0.955,0; 6 0.955,0.65
SOT23-WIDE = smd 1 x 1.27: 1 -0.95,-1; 2 0.95,-1; 3 0,1
3386P = drill 0.813 pad 1.676 octagon: 1 -2.54,0; 2 0,-2.54; 3 2.54,0
SOLDERJUMPER_2WAY_OPEN_NOPASTE = smd 1.168 x 1.6: 1 -1.397,0; 2 0,0; 3 1.397,0
SKA20SERIES = drill 1.1: 1 -2.54,10.16; 2 2.54,10.16; 3 10.16,-10.16; 4 0,-10.16; 5 -10.16,-10.16; 6 10.16,10.16
749022012X = smd 2.29 x 0.76: 1 -7.24,6.985; 2 -7.24,5.715; 3 -7.24,4.445; 4 -7.24,3.175; 5 -7.24,1.905; 6 -7.24,0.635; 7 -7.24,-0.635; 8 -7.24,-1.905; 9 -7.24,-3.175; 10 -7.24,-4.445; 11 -7.24,-5.715; 12 -7.24,-6.985; 13 7.24,-6.985; 14 7.24,-5.715; 15 7.24,-4.445; 16 7.24,-3.175; 17 7.24,-1.905; 18 7.24,-0.635; 19 7.24,0.635; 20 7.24,1.905; 21 7.24,3.175; 22 7.24,4.445; 23 7.24,5.715; 24 7.24,6.985
632723100011 = smd 0.3 x 1.2: A1 -2.75,5.93; A2 -2.25,5.93; A3 -1.75,5.93; A4 -1.25,5.93; A5 -0.75,5.93; A6 -0.25,5.93; A7 0.25,5.93; A8 0.75,5.93; A9 1.25,5.93; A10 1.75,5.93; A11 2.25,5.93; A12 2.75,5.93 | drill 0.4 pad 0.65: B1 2.8,4.68; B2 2.4,3.98; B3 1.6,3.98; B4 1.2,4.68; B5 0.8,3.98; B6 0.4,4.68; B7 -0.4,4.68; B8 -0.8,3.98; B9 -1.2,4.68; B10 -1.6,3.98; B11 -2.4,3.98; B12 -2.8,4.68; GND 2,4.68; GND1 -2,4.68 | drill 0.6 pad 1 long: S1 -4.27,3.53; S2 4.27,3.53; S3 4.27,-1.2; S4 -4.27,-1.2

### Placement (x,y rotation side)
5V  5.4,78.42 90 top
AUTOCLASS  76.36,30.32 0 top
C1  24.45,24.07 270 top
C2  70.8,33.72 0 top
C3  66.04,25.72 90 bottom
C4  66.04,18.1 90 bottom
C5  77.53,44.77 180 top
C6  63.18,62.23 0 top
C8  53.02,23.75 90 top
C10  84.3,59.69 0 top
C12  56.52,74.93 0 top
C17  49.85,36.56 0 top
C18  49.85,28.94 0 top
C19  49.85,32.75 0 top
C20  49.85,40.37 0 top
D1  77.47,19.05 90 top
D2  77.47,26.67 90 top
D3  70.8,30.54 0 top
EXT_FB  80.33,86.36 0 top
FB_24V_IN  92.08,49.85 90 top
FID1  1.91,85.09 0 top
FID2  82.55,2.54 0 bottom
FID3  1.91,85.09 0 bottom
FID5  82.55,2.54 0 top
H1  7.5,7.5 0 top
H2  7.5,87.5 0 top
H3  87.5,87.5 0 top
H4  87.5,7.5 0 top
H5  73.03,4.45 0 top
IC1  78.96,38.42 270 top
IC2  70.8,25.72 180 top
IC3  70.8,18.1 180 top
INT_FB  61.28,86.36 0 top
J1  37.78,8.35 0 top
J2  53,90.5 180 top
J3  72,90.5 180 top
J4  36,86.7 180 top
JP3  59.37,49.53 0 top
K1  84.14,74.93 0 top
LCF  6.99,19.37 90 top
NCL  6.99,16.83 90 top
NCM  6.99,14.29 90 top
NMOS  76.68,63.34 0 top
PAD1  44.77,67.31 0 bottom
PAD2  40.01,67.31 0 bottom
PAD3  30.16,67.31 0 bottom
PAD4  25.4,67.31 0 bottom
PG  6.99,21.91 90 top
POE_OUT  92.08,26.35 90 top
Q1  76.52,26.35 180 bottom
Q2  65.41,28.73 180 bottom
Q3  65.41,21.11 180 bottom
Q4  76.52,18.73 180 bottom
Q5  90.48,64.29 0 top
R1  26.35,40.37 180 top
R2  26.35,36.56 180 top
R3  26.35,32.75 180 top
R4  26.35,28.94 180 top
R5  77.47,15.4 180 top
R6  77.47,23.02 180 top
R7  74.24,74.58 180 top
R8  15.72,78.74 180 bottom
R9  77.53,43.02 0 top
R10  11.43,21.91 0 bottom
R11  11.43,14.29 0 bottom
R12  11.43,16.83 0 bottom
R13  11.43,19.37 0 bottom
R14  4.13,42.55 180 bottom
R15  9.84,78.42 0 bottom
R16  80.33,81.92 0 bottom
R17  90.49,60.96 180 top
R18  78.9,32.38 180 bottom
R19  61.28,81.92 0 bottom
R21  84.3,65.72 180 top
R22  84.3,63.66 0 top
R23  78.98,34.31 180 bottom
R24  54.29,36.56 180 top
R25  54.29,28.94 180 top
R27  90.48,59.21 180 top
R28  54.29,32.75 180 top
R29  54.29,40.37 180 top
SJ1  75.88,48.58 180 top
SJ2  76.52,52.07 180 top
SJ3  76.52,56.67 0 top
SKA-20C-05  25.35,61.91 90 top
T1  38.42,33.38 0 top
USB'S  19.68,78.74 270 top
USB_1  3.71,34.92 270 top
USB_2  20.5,91.3 180 top
USB_RPI  9.53,42.55 270 top

### Tracks (layer width: path | path; a pad name or v marks a point on that pad's centre or on a via)
5VFB_GND  (via drill 0.31)
  Top 0.254: USB_2.GND1 USB_2.B12 | USB_2.A12 17.75,84.74 17.46,84.45 16.83,84.45 v16.67,84.61 | USB'S.C v22.07,78.74 | USB_RPI.C v11.91,42.55
  Top 0.305: USB_1.A12 10.69,32.17 v11.11,31.75
  Top 0.31: SJ1.1 76.64,48.13 v77.63,47.15
  Top 0.406: INT_FB.C 61.28,89.22 60.48,90.01 51.28,90.01 50.48,89.22 50.48,88.02 J2.2 | 5V.C v2.86,78.42
  Route15 0.254: USB_2.GND 18.5,85.48 18.57,85.41 | USB_1.GND1 USB_1.B12 | USB_1.GND 9.3,32.92 9.37,32.86
  Route15 1.016: H5.B3,2 75.72,4.45 85.25,13.97 85.25,46.35 84.77,46.83
  pour Route15 (isolate 0.406, rank 6): -8.26,102.23 114.3,102.23 114.3,46.04 17.46,46.04 17.46,28.26 -8.26,28.26
5VFB_VIN  (via drill 0.31)
  other vias: 76.2,50.64 76.83,50.64 76.52,50.16 76.2,53.5 76.83,53.5
  pour Top (isolate 0.406, rank 3): 75.72,53.82 77.47,53.82 77.47,50.01 75.72,50.01
  pour Route2 (isolate 0.406): 13.49,60.48 13.49,57.63 16.19,57.63 23.34,64.77 38.1,64.77 38.89,65.56 44.93,65.56 54.45,56.04 68.42,56.04 74.45,50.01 77.47,50.01 77.47,53.82 74.45,53.82 69.53,58.74 54.93,58.74 46.2,67.47 20.48,67.47
5VFB_VOUT  (via drill 0.31)
  Bottom 0.305: PAD3.1 v30.16,68.42 | PAD1.1 v44.77,68.42
  Bottom 0.406: R15.1 10.69,77.25 v10.79,77.15
  other vias: 43.97,69.22 44.77,69.22 45.56,69.22 45.56,68.42 43.97,68.42 29.37,69.22 30.16,69.22 29.37,68.42 30.96,68.42 30.96,69.22
  pour Route2 (isolate 0.406, rank 6): 17.46,28.42 17.46,46.04 18.1,46.04 99.85,46.04 99.85,101.12 -6.83,101.12 -6.83,28.26 17.46,28.26
CGND
  pour Bottom: 19.68,-11.43 19.68,23.59 55.56,23.59 55.56,-11.43
  pour Top: 55.56,-6.99 55.56,23.59 19.68,23.59 19.68,-6.99
DA_IN_N  (via drill 0.31)
  Top 0.711: 46.83,26.4 T1.13
  Top 0.762: v48.58,26.56 v47.94,26.56 v47.31,26.56 46.99,26.56 46.83,26.4
  Route2 0.762: v48.58,26.56 v47.94,26.56 v47.31,26.56 46.04,26.56 41.59,22.11 J1.B2
DA_IN_P  (via drill 0.31)
  Top 0.711: 46.99,27.51 46.83,27.67
  Top 0.762: v48.58,27.51 v47.94,27.51 v47.31,27.51 46.99,27.51 | 46.83,27.67 T1.14
  Route2 0.406: J1.B1 40.32,18.03
  Route2 0.762: 40.32,18.03 40.64,18.35 40.64,22.51 45.64,27.51 v47.31,27.51 v47.94,27.51 v48.58,27.51
DA_OUT_N  (via drill 0.31)
  Top 0.762: T1.12 29.84,26.4 29.69,26.56 v29.05,26.56
  Route2 0.762: v29.05,26.56 28.42,26.56 27.62,25.77 J1.A2
DA_OUT_P  (via drill 0.31)
  Top 0.762: T1.11 29.84,27.67 29.69,27.51 v29.05,27.51
  Route2 0.406: 26.35,18.03 J1.A1
  Route2 0.762: v29.05,27.51 28.02,27.51 26.67,26.16 26.67,18.35 26.35,18.03
DB_IN_N  (via drill 0.31 pad 0.31)
  Top 0.762: v48.58,35.13 v47.94,35.13 v47.31,35.13 46.99,35.13 46.83,35.29 T1.20
  Route2 0.762: J1.B6 46.67,20.1 47.62,21.05 50.88,21.05 52.86,23.03 52.86,32.35 50.09,35.13 v47.31,35.13
DB_IN_P  (via drill 0.31 pad 0.31)
  Top 0.762: v48.58,34.18 v47.94,34.18 v47.31,34.18 46.99,34.18 46.83,34.02 T1.19
  Route2 0.406: J1.B3 44.23,16.29 45.09,16.29 45.4,16.61 45.4,18.35
  Route2 0.762: v47.31,34.18 49.69,34.18 51.91,31.96 51.91,23.43 50.48,22 47.23,22 45.72,20.49 45.72,18.67 45.4,18.35
DB_OUT_N  (via drill 0.31)
  Top 0.762: v29.05,35.13 29.69,35.13 29.84,35.29 T1.5
  Route2 0.762: J1.A6 32.7,18.51 33.02,18.83 33.02,23.23 33.66,23.86 36.35,23.86 37.31,24.81 37.31,32.51 34.69,35.13 v29.05,35.13
DB_OUT_P  (via drill 0.31)
  Top 0.762: T1.6 29.84,34.02 29.69,34.18 v29.05,34.18
  Route2 0.406: 31.59,18.83 31.59,16.76 30.96,16.13 30.11,16.13 J1.A3
  Route2 0.762: v29.05,34.18 34.29,34.18 36.35,32.12 36.35,25.21 35.96,24.81 33.26,24.81 32.07,23.62 32.07,19.3 31.59,18.83
DC_IN_N  (via drill 0.31 pad 0.31)
  Top 0.762: v48.58,37.99 v47.94,37.99 v47.31,37.99 46.99,37.99 46.83,37.83 T1.22
  Route15 0.762: v47.31,37.99 54.13,37.99 57.63,34.5 57.63,21.53 49.37,13.27 46.04,13.27 45.4,13.91 J1.B5
DC_IN_P  (via drill 0.31 pad 0.31)
  Top 0.762: v48.58,38.94 v47.94,38.94 v47.31,38.94 46.99,38.94 46.83,39.1 T1.23
  Route15 0.406: J1.B4 44.29,17.3 44.29,14.06
  Route15 0.762: v47.31,38.94 54.53,38.94 58.58,34.89 58.58,21.11 49.78,12.32 45.64,12.32 44.45,13.51 44.45,13.91 44.29,14.06
DC_OUT_N  (via drill 0.31)
  Top 0.762: T1.3 29.84,37.83 29.69,37.99 v29.05,37.99
  Route15 0.406: 31.27,18.35 31.27,15.07 J1.A5
  Route15 0.762: v29.05,37.99 27.94,37.99 25.56,35.61 25.56,24.7 26.04,24.23 29.45,24.23 31.11,22.56 31.11,18.51 31.27,18.35
DC_OUT_P  (via drill 0.31)
  Top 0.762: v29.05,38.94 29.69,38.94 29.84,39.1 T1.2
  Route15 0.762: J1.A4 30.16,22.16 29.05,23.27 25.64,23.27 24.61,24.3 24.61,36 27.54,38.94 v29.05,38.94
DD_IN_N  (via drill 0.31 pad 0.31)
  Top 0.762: T1.17 46.83,31.48 46.99,31.32 v48.58,31.32
  Route15 0.762: J1.B8 49.21,23.38 50.48,24.65 50.48,30.13 49.29,31.32 v48.58,31.32 v47.94,31.32 v47.31,31.32
DD_IN_P  (via drill 0.31 pad 0.31)
  Top 0.406: T1.16 46.83,30.21
  Top 0.762: 46.83,30.21 46.99,30.37 v48.58,30.37
  Route15 0.406: J1.B7 47.94,18.35
  Route15 0.762: 47.94,18.35 48.26,18.67 48.26,23.78 49.53,25.05 49.53,29.73 48.9,30.37 v48.58,30.37 v47.94,30.37 v47.31,30.37
DD_OUT_N  (via drill 0.31)
  Top 0.762: T1.8 29.84,31.48 29.69,31.32 v29.05,31.32
  Route15 0.762: J1.A8 35.24,29.5 33.42,31.32 v29.05,31.32
DD_OUT_P  (via drill 0.31)
  Top 0.762: T1.9 29.84,30.21 29.69,30.37 v29.05,30.37
  Route15 0.406: J1.A7 33.97,18.19
  Route15 0.762: 33.97,18.19 34.29,18.51 34.29,29.1 33.02,30.37 v29.05,30.37
EXTFB_GND  (via drill 0.31)
  Top 0.31: SJ1.2 75.12,48.07 v76.04,47.15
  Top 0.406: EXT_FB.C 80.33,88.42 79.38,89.38 70.84,89.38 J3.2
  Bottom 0.31: v76.04,47.15 76.83,46.35 86.08,46.35 FB_24V_IN.2
  pour Route15 (isolate 0.406): 64.45,100.17 64.45,81.44 87.63,81.44 87.63,43.66 103.03,43.66 103.03,101.28 64.45,101.28
EXTFB_V+
  Bottom 0.406: R16.1 81.18,80.38 80.64,79.85 75.56,79.85 74.61,80.8 74.61,87.93 J3.1
  pour Route2 (isolate 0.406): 64.45,98.11 64.45,81.44 87.63,81.44 87.63,43.66 97.95,43.66 97.95,98.11
LCF  (via drill 0.31)
  Top 0.305: LCF.C 5.08,19.37 4.76,19.68 4.76,22.86 6.03,24.13 16.51,24.13 17.46,25.08 17.46,43.81 19.68,46.04 v67.63,46.04 | v83.19,38.1 82.55,38.73 IC1.13
  Route2 0.305: v67.63,46.04 69.22,44.45 80.96,44.45 83.82,41.59 83.82,38.73 v83.19,38.1
MCT_A  (via drill 0.31)
  Top 0.305: v63.02,28.1 62.87,27.94 v62.87,24.77
  Top 0.406: v69.06,24.92 69.1,24.97 IC2.15 | IC2.15 69.67,24.92 v69.69,24.92 v70.33,24.92 | IC2.15 IC2.16
  Top 0.762: C18.1 T1.15 43.97,28.94 40.32,32.59 40.32,42.55 41.91,44.13 59.37,44.13 61.59,41.91 61.59,25.4 v62.23,24.77 v62.87,24.77 v63.5,24.77
  Bottom 0.305: Q2.4 65.58,29.38 65.41,29.21 65.41,28.26 65.23,28.08 Q2.1 64.44,28.1 v63.02,28.1
  Bottom 0.762: v62.23,24.77 v62.87,24.77 v63.5,24.77 64.77,24.77 64.87,24.87 C3.1 66.1,24.92 v70.33,24.92
MCT_B  (via drill 0.31)
  Top 0.305: v72.71,26.51 72.66,26.47 IC2.13
  Top 0.406: v69.06,26.51 69.1,26.47 IC2.14 | IC2.14 69.67,26.51 v69.69,26.51 v70.33,26.51 | IC2.14 IC2.13
  Top 0.762: C17.1 T1.21 v42.7,36.56
  Bottom 0.305: Q1.4 76.85,27 76.52,26.67 76.52,26.04 76.19,25.7 Q1.1 75.55,25.72 74.77,25.72 73.98,26.51 v72.71,26.51
  Bottom 0.762: v43.97,36.56 v43.34,36.56 v42.7,36.56 41.86,36.56 40.32,38.1 40.32,42.55 41.91,44.13 59.37,44.13 61.59,41.91 61.59,27.3 62.33,26.57 C3.2 66.1,26.51 v70.33,26.51
MCT_C  (via drill 0.31, 0.31 pad 0.31)
  Top 0.406: v69.06,17.3 69.1,17.35 IC3.15 69.67,17.3 | v70.33,17.3 v69.69,17.3 71.93,17.3 IC3.16
  Top 0.762: C20.1 T1.24 v43.97,40.37 v43.34,40.37 v42.7,40.37 | 69.67,17.3 v69.69,17.3
  Bottom 0.305: Q3.1 65.23,20.46 | 65.23,20.46 65.41,20.64 65.41,21.59 65.58,21.76 Q3.4 | 65.23,20.46 65.22,20.48 60.33,20.48
  Bottom 0.762: v43.97,40.37 v42.7,40.37 45.09,40.37 47.58,42.86 58.74,42.86 60.33,41.27 60.33,20.48 60.33,18.73 61.81,17.25 C4.1 66.1,17.3 v70.33,17.3
MCT_D  (via drill 0.31)
  Top 0.305: v72.71,18.73 72.59,18.85 IC3.13
  Top 0.406: v69.06,18.89 69.1,18.85 IC3.14 69.67,18.89 v69.69,18.89 | v69.69,18.89 v70.33,18.89 | IC3.13 71.93,18.89 v69.69,18.89
  Top 0.762: C19.1 T1.18 43.66,32.75 41.59,34.81 41.59,41.59 42.86,42.86 58.74,42.86 60.33,41.27 60.33,20.64 61.91,19.05 v63.5,19.05
  Bottom 0.305: Q4.4 76.85,19.38 76.52,19.05 76.52,18.41 76.19,18.08 Q4.1 75.55,18.1 74.77,18.1 74.14,18.73 v72.71,18.73
  Bottom 0.762: v62.23,19.05 v62.87,19.05 v63.5,19.05 64.45,19.05 64.56,18.95 C4.2 66.1,18.89 v70.33,18.89
N$1
  Top 0.762: R4.1 T1.10
N$2
  Top 0.762: R3.1 T1.7
N$3
  Top 0.762: R2.1 T1.4
N$4  (via drill 0.31)
  Top 0.31: v73.03,66.83 83.03,66.83 83.45,66.41 R21.2 R22.1 83.45,59.84 C10.2 | v71.91,61.44 NMOS.4
  Route2 0.305: v73.03,66.83 72.07,66.83 70.17,64.93 70.17,63.18 v71.91,61.44
N$5
  Top 0.762: R1.1 T1.1
N$6  (via drill 0.31)
  Top 0.406: INT_FB.A 61.28,84.45 v60.33,83.5
  Bottom 0.406: v60.33,83.5 60.33,82.02 R19.2
N$7
  Top 0.406: 25.4,28.3 R4.2 | 25.4,35.29
  Top 0.762: C1.1 24.45,26.77 25.4,27.72 25.4,28.3 | R4.2 R3.2 25.4,35.29 | 25.4,35.29 25.4,35.92 R2.2 R1.2
N$8  (via drill 0.31)
  Top 0.254: IC1.2 74.65,40.04 v74.3,39.69 | K1.4 87.76,77.18 87.95,76.99 87.95,75.41 88.27,75.09 92.87,75.09 93.66,74.3 93.66,59.05 88.74,54.13 88.74,38.73 v87.79,37.78
  Route2 0.254: v87.79,37.78 84.61,37.78 v81.76,34.92
  Bottom 0.254: v74.3,39.69 73.18,38.58 73.18,35.56 76.36,32.38 R18.1 78.11,32.32 78.11,31.59 78.42,31.27 81.12,31.27 81.76,31.91 v81.76,34.92
N$9
  Top 0.762: R29.1 R24.1 R28.1 R25.1 55.24,28.3 55.24,27.99 54.61,27.35 53.98,27.35 53.02,26.4 C8.2
N$10  (via drill 0.31)
  Top 0.406: NCM.A v9.53,14.29
  Bottom 0.406: v9.53,14.29 R11.2
N$11  (via drill 0.31)
  Top 0.254: IC1.7 75.19,36.79 v74.68,37.31 | v75.63,43.02 R9.1
  Bottom 0.254: v75.63,43.02 75.31,42.7 75.31,37.94 v74.68,37.31
N$12
  Top 0.254: IC1.5 76.89,38.09 77.06,38.26 77.06,41.27 77.53,41.75 78.01,41.75 78.38,42.12 R9.2 C5.1
N$13  (via drill 0.31)
  Top 0.406: PG.A v9.53,21.91
  Bottom 0.406: v9.53,21.91 R10.2
N$14  (via drill 0.31)
  Top 0.305: R5.1 78.42,15.5 v78.42,16.03 | v63.66,21.11 v67.15,21.11
  Route2 0.305: v78.42,16.03 77.79,16.67 74.45,16.67 73.82,17.3 73.82,19.37 73.5,19.68 67.79,19.68 67.15,20.32 v67.15,21.11
  Bottom 0.305: v67.15,21.11 Q3.5 | Q3.2 v63.66,21.11
N$15  (via drill 0.31)
  Top 0.406: NCL.A v9.53,16.83
  Bottom 0.406: v9.53,16.83 R12.2
N$16  (via drill 0.31)
  Top 0.305: D1.2 v78.42,18.89
  Route2 0.305: v75.25,18.73 78.26,18.73 v78.42,18.89
  Bottom 0.305: v78.42,18.89 78.26,18.73 Q4.5 | Q4.2 v75.25,18.73
N$17  (via drill 0.31)
  Top 0.305: v70.33,20.8 70.4,20.72 IC3.4
  Bottom 0.305: Q3.6 66.38,20.48 70.01,20.48 v70.33,20.8
N$18  (via drill 0.31)
  Top 0.305: v72.71,20.95 72.8,20.86 IC3.1
  Route2 0.305: v63.66,21.91 71.75,21.91 v72.71,20.95
  Bottom 0.305: Q3.3 64.44,21.75 63.82,21.75 v63.66,21.91
N$19  (via drill 0.31)
  Top 0.406: LCF.A v9.53,19.37
  Bottom 0.406: v9.53,19.37 R13.2
N$20
  Top 0.762: C17.2 R24.2
N$21
  Top 0.762: C18.2 R25.2
N$22
  Top 0.762: C19.2 R28.2
N$23
  Top 0.762: C20.2 R29.2
N$24  (via drill 0.31)
  Top 0.305: v73.18,15.4 72.8,15.78 IC3.12
  Route15 0.305: v74.61,19.37 74.3,19.05 74.3,16.19 73.5,15.4 v73.18,15.4
  Bottom 0.305: Q4.3 75.55,19.37 v74.61,19.37
N$25  (via drill 0.31)
  Top 0.305: v70.48,14.92 70.4,15.01 IC3.9
  Bottom 0.305: Q4.6 76.98,18.08 76.83,17.94 76.83,15.72 75.72,14.61 70.8,14.61 v70.48,14.92
N$26  (via drill 0.31)
  Top 0.305: v63.5,28.73 v67.15,28.73 | R6.1 78.42,23.12 v78.42,23.81
  Route2 0.305: v78.42,23.81 77.95,24.29 74.45,24.29 73.82,24.92 73.82,26.99 73.5,27.3 67.79,27.3 67.15,27.94 v67.15,28.73
  Bottom 0.305: Q2.2 v63.5,28.73 | v67.15,28.73 Q2.5
N$27  (via drill 0.31)
  Top 0.254: IC1.3 74.95,39.39 v74.45,38.89 | K1.2 92.84,77.18 94.14,75.88 94.14,58.9 89.22,53.98 89.22,38.42 v87.79,36.99
  Route2 0.254: v87.79,36.99 84.61,36.99 81.92,34.29 v78.26,34.29
  Bottom 0.254: v74.45,38.89 73.82,38.26 73.82,35.56 75.06,34.31 R23.1 78.15,34.29 v78.26,34.29
N$29
  Top 0.305: D1.1 76.52,15.5 R5.2
N$30  (via drill 0.31)
  Top 0.254: IC1.6 76.86,37.44 v76.99,37.31 | v76.99,31.75 76.99,30.51 AUTOCLASS.2
  Route2 0.254: v76.99,37.31 v76.99,31.75
N$31  (via drill 0.31)
  Top 0.305: D2.2 v78.42,26.51
  Route2 0.305: v75.25,26.35 78.26,26.35 v78.42,26.51
  Bottom 0.305: v78.42,26.51 78.26,26.35 Q1.5 | Q1.2 v75.25,26.35
N$32  (via drill 0.31)
  Top 0.305: v70.33,28.42 70.4,28.34 IC2.4
  Bottom 0.305: Q2.6 66.38,28.1 70.01,28.1 v70.33,28.42
N$33  (via drill 0.31)
  Top 0.305: v72.71,28.42 72.8,28.32 IC2.1
  Route2 0.305: v63.66,29.53 71.6,29.53 v72.71,28.42
  Bottom 0.305: Q2.3 64.44,29.37 63.82,29.37 v63.66,29.53
N$34  (via drill 0.31)
  Top 0.305: v73.18,23.02 72.8,23.4 IC2.12
  Route15 0.305: v74.61,26.99 74.3,26.67 74.3,23.65 73.66,23.02 v73.18,23.02
  Bottom 0.305: Q1.3 75.55,26.99 v74.61,26.99
N$35  (via drill 0.31)
  Top 0.254: USB'S.A v17.62,78.74
  Bottom 0.254: v17.62,78.74 R8.2
N$36
  Top 0.305: D2.1 76.52,23.12 R6.2
N$37  (via drill 0.31)
  Top 0.305: v70.48,22.7 70.4,22.78 IC2.9
  Bottom 0.305: Q1.6 76.98,25.7 76.83,25.56 76.83,23.5 75.72,22.38 70.8,22.38 v70.48,22.7
N$38  (via drill 0.31)
  Top 0.254: USB_RPI.A v6.99,42.55
  Bottom 0.254: v6.99,42.55 R14.2
N$39  (via drill 0.31)
  Top 0.305: 5V.A v7.78,78.42
  Bottom 0.305: v7.78,78.42 R15.2
N$40  (via drill 0.31)
  Top 0.406: EXT_FB.A 80.33,84.61 v79.38,83.66
  Bottom 0.406: v79.38,83.66 79.38,82.02 R16.2
N$41  (via drill 0.6)
  Top 0.406: v63.66,70.96 42.07,70.96 35.56,64.45 35.56,61.96 SKA-20C-05.4
  Route2 0.406: v63.66,70.96 69.85,77.15 74.21,77.15 R7.2
N$43  (via drill 0.31, 0.6)
  Top 0.305: v35.4,56.99 14.29,56.99 11.59,59.69 11.59,68.47 SKA-20C-05.6
  Top 0.31: SJ3.2 76.52,54.77 v76.2,54.45
  Route2 0.305: 38.31,54.45 37.94,54.45 v35.4,56.99
  Route2 0.31: v65.41,54.45 38.31,54.45
  Route15 0.31: v76.2,54.45 v65.41,54.45
NCL  (via drill 0.31)
  Top 0.305: NCL.C 4.76,16.83 4.13,17.46 4.13,23.18 5.71,24.77 16.19,24.77 16.83,25.4 16.83,44.13 19.37,46.67 68.26,46.67 v68.58,46.35 | v82.87,44.13 82.87,41.27 82.28,40.69 IC1.16
  Route2 0.305: v68.58,46.35 68.58,46.04 69.53,45.09 74.93,45.09 75.56,45.72 81.28,45.72 v82.87,44.13
NCM  (via drill 0.31)
  Top 0.305: NCM.C 4.13,14.29 3.49,14.92 3.49,23.5 5.4,25.4 15.88,25.4 16.19,25.72 16.19,44.45 19.05,47.31 v52.39,47.31 | IC1.15 82.59,40.04 v82.87,40.32
  Route2 0.305: v52.39,47.31 53.66,46.04 66.67,46.04 68.9,43.81 80.64,43.81 82.87,41.59 v82.87,40.32
PERIFERALS_V+  (via drill 0.31)
  Top 0.254: USB_2.B4 19.25,86.57 USB_2.A9 19.25,84.1 19.37,83.98 21.59,83.98 21.75,84.14 USB_2.A4 21.75,86.57 USB_2.B9
  Route15 1.016: JP3.7 JP3.8 61.91,54.29 58.9,57.31 48.9,57.31 v45.24,60.96 v43.66,60.96
  Bottom 0.406: R19.1 62.13,80.54 61.28,79.69 58.26,79.69 58.1,79.53
  Bottom 1.016: 25.24,63.98 25.24,63.5 28.73,60.01 37.15,60.01 38.1,60.96 v43.66,60.96 v44.45,60.96 v45.24,60.96
  other vias: 19.53,83.66 20.16,83.66 20.8,83.66 21.43,83.66
  pour Bottom (isolate 0.406): 13.81,89.38 13.81,75.25 18.26,75.25 18.26,63.98 27.94,63.98 27.94,77.15 58.42,77.31 58.42,96.04 58.26,96.04 58.26,97.95 47.15,97.95 47.15,89.38
  pour Top (isolate 0.406): 14.76,89.22 26.19,89.22 26.19,83.03 14.76,83.03
PG  (via drill 0.31)
  Top 0.31: Q5.1 89.53,61.06 R17.2 R27.2 | R27.2 | R27.2 87.63,59.22 v86.52,60.33 | v75.09,57.47 75.09,56.71 SJ3.1 | IC1.14 82.89,39.39 v83.03,39.53
  Route2 0.31: v86.52,60.33 86.04,60.8 78.42,60.8 v75.09,57.47
  Route15 0.305: 79.06,56.04 82.87,52.23 82.87,52.07
  Route15 0.31: v83.03,39.53 83.82,40.32 83.82,44.77 82.87,45.72 82.87,52.07 | 79.06,56.04 75.88,56.04 75.09,56.83 v75.09,57.47
PGND  (via drill 0.31, 0.31 pad 0.31)
  Top 0.31: SJ3.3 77.92,54.58 v77.79,54.45 | R17.1 91.43,61.06 Q5.2 92.5,63.29 v92.55,63.34
  Top 0.406: IC1.17 80.23,38.42 80.55,38.1 IC1.12
  other vias: 78.96,38.42 78.17,38.42 78.17,39.21 78.96,39.21 79.76,39.21 79.76,38.42 79.76,37.62 78.96,37.62 78.17,37.62
  pour Bottom (isolate 0.406, rank 6): -10.79,104.78 104.78,104.78 104.78,-15.56 60.01,-15.56 60.01,46.04 17.46,46.04 17.46,-15.56 -10.79,-15.56
PGOOD  (via drill 0.31)
  Top 0.305: PG.C 5.93,23.08 6.35,23.5 16.83,23.5 18.1,24.77 18.1,43.5 20,45.4 69.22,45.4 v69.85,46.04 | v85.09,65.72 R21.1
  Top 0.31: Q5.3 86.95,65.29 86.52,65.72 R21.1
  Bottom 0.305: v69.85,46.04 69.85,60.64 74.93,65.72 v85.09,65.72
POE_V+  (via drill 0.31)
  Top 0.31: R27.1 91.33,58.16 90.65,57.47 87.52,57.47 C10.1 85.15,59.84 R22.2 85.15,64.24 v84.77,64.61
  Route2 0.31: v84.77,64.61 72.23,64.61 v71.75,64.14
  Bottom 0.305: R12.1 16.19,16.83 17.46,18.1 17.46,43.18 20,45.72 65.09,45.72 68.26,42.55 v71.44,42.55
  Bottom 0.406: R10.1 R13.1 R12.1 R11.1
  pour Top (rank 2): 70.64,14.45 67.31,14.45 67.31,37.31 71.12,41.12 71.12,58.74 70.01,59.85 65.88,59.85 64.77,60.96 64.77,64.93 65.88,66.04 74.93,66.04 75.09,65.88 75.09,60.48 73.66,59.05 73.66,54.45 74.45,53.66 75.41,53.66 75.41,50.64 74.45,50.64 73.66,49.85 73.66,43.97 76.83,40.96 76.74,40.96 76.74,40.48 74.68,40.48 72.14,37.78 70.64,36.35
POE_V+_SS
  pour Top (isolate 0.406): 75.56,66.2 75.56,60.48 76.04,60.01 79.22,60.01 80.33,58.9 80.33,54.61 79.22,53.5 77.79,53.5 77.79,50.64 82.55,50.64 83.98,49.21 83.98,17.14 97.16,17.14 97.16,34.29 88.74,34.29 86.68,36.35 86.68,50.16 82.23,54.61 82.23,66.2
USB-C_1_V+  (via drill 0.31)
  Top 0.254: 11.11,36.2 11.09,36.17 USB_1.A4 8.44,36.17 USB_1.B9 | USB_1.A9 11.09,33.67 11.11,33.66
  Top 0.305: USB_1.A9 8.44,33.67 USB_1.B4
  Top 1.016: 11.11,36.2 11.11,39.21 11.91,40.01 14.29,40.01 15.08,40.8 15.08,48.74 21.75,55.4 36.51,55.4 40.01,58.9 v40.01,64.29
  Route15 1.016: JP3.5 JP3.6 59.37,53.34 56.99,55.72 46.99,55.72 40.01,62.71 v40.01,64.29
  Bottom 0.254: R14.1 3.28,41.65 3.81,41.12 5.08,41.12 v5.87,40.32
  Bottom 1.016: PAD2.1 v40.01,64.29 v40.01,63.66 v40.01,63.02
  pour Top (isolate 0.406): 5.56,40.64 12.54,40.64 12.54,29.21 5.56,29.21
VPN  (via drill 0.31)
  Top 0.254: v76.58,45.09 C5.2 | 79.06,36.04 v79.22,35.88 78.95,36.14 IC1.8 | 74.01,35.53 v74.52,36.04 | K1.1 K1.3 92.42,72.68 93.19,71.91 93.19,59.21 88.27,54.29 88.27,39.05 v87.79,38.58
  Bottom 0.254: v74.52,36.04 76.26,37.78 76.26,44.77 v76.58,45.09 | R23.2 79.83,35.27 | 79.83,35.27 v79.22,35.88 | v87.79,38.58 87.63,38.42 84.45,38.42 83.19,37.15 81.71,37.15 79.83,35.27
  Bottom 0.406: R18.2 79.75,34.23 R23.2
  pour Top: 71.12,14.45 71.18,36.2 76.9,36.2 76.9,35.15 76.04,34.29 76.04,29.37 74.3,27.62 74.45,14.45

### Text on the board
tPlace: GND | 5V | GND | V+ | INTERNAL FLYBACK | EXTERNAL FLYBACK | INTERNAL / FLYBACK | CLASSIFICATION | PG | RC | PGND | VIN | FB | SS | UPS extention | GND | 24VFB GND | 5VFB GND | TECHTILE POE POWER MANAGEMENT BOARD | V+ | Jarne Van Mulders | EXTERNAL FLYBACK | INPUT | USB C RPI | POE- | POE LEDS | E OUT | PoE IN | EXTERNAL FLYBACK | POE+ | OUTPUT | 5V Flyback Converter | GND | Ground / Reference | Ground / Reference
bPlace: Solderpads Switches | Other USBs | RPI USB C | TECHTILE POE POWER MANAGEMENT BOARD | Jarne Van Mulders | Power Over Ethernet / Power Management Board | V1.4 | Jarne Van Mulders